# EAGLE design module (EAGLE 9.6.2)

## Sheet 1 of 5
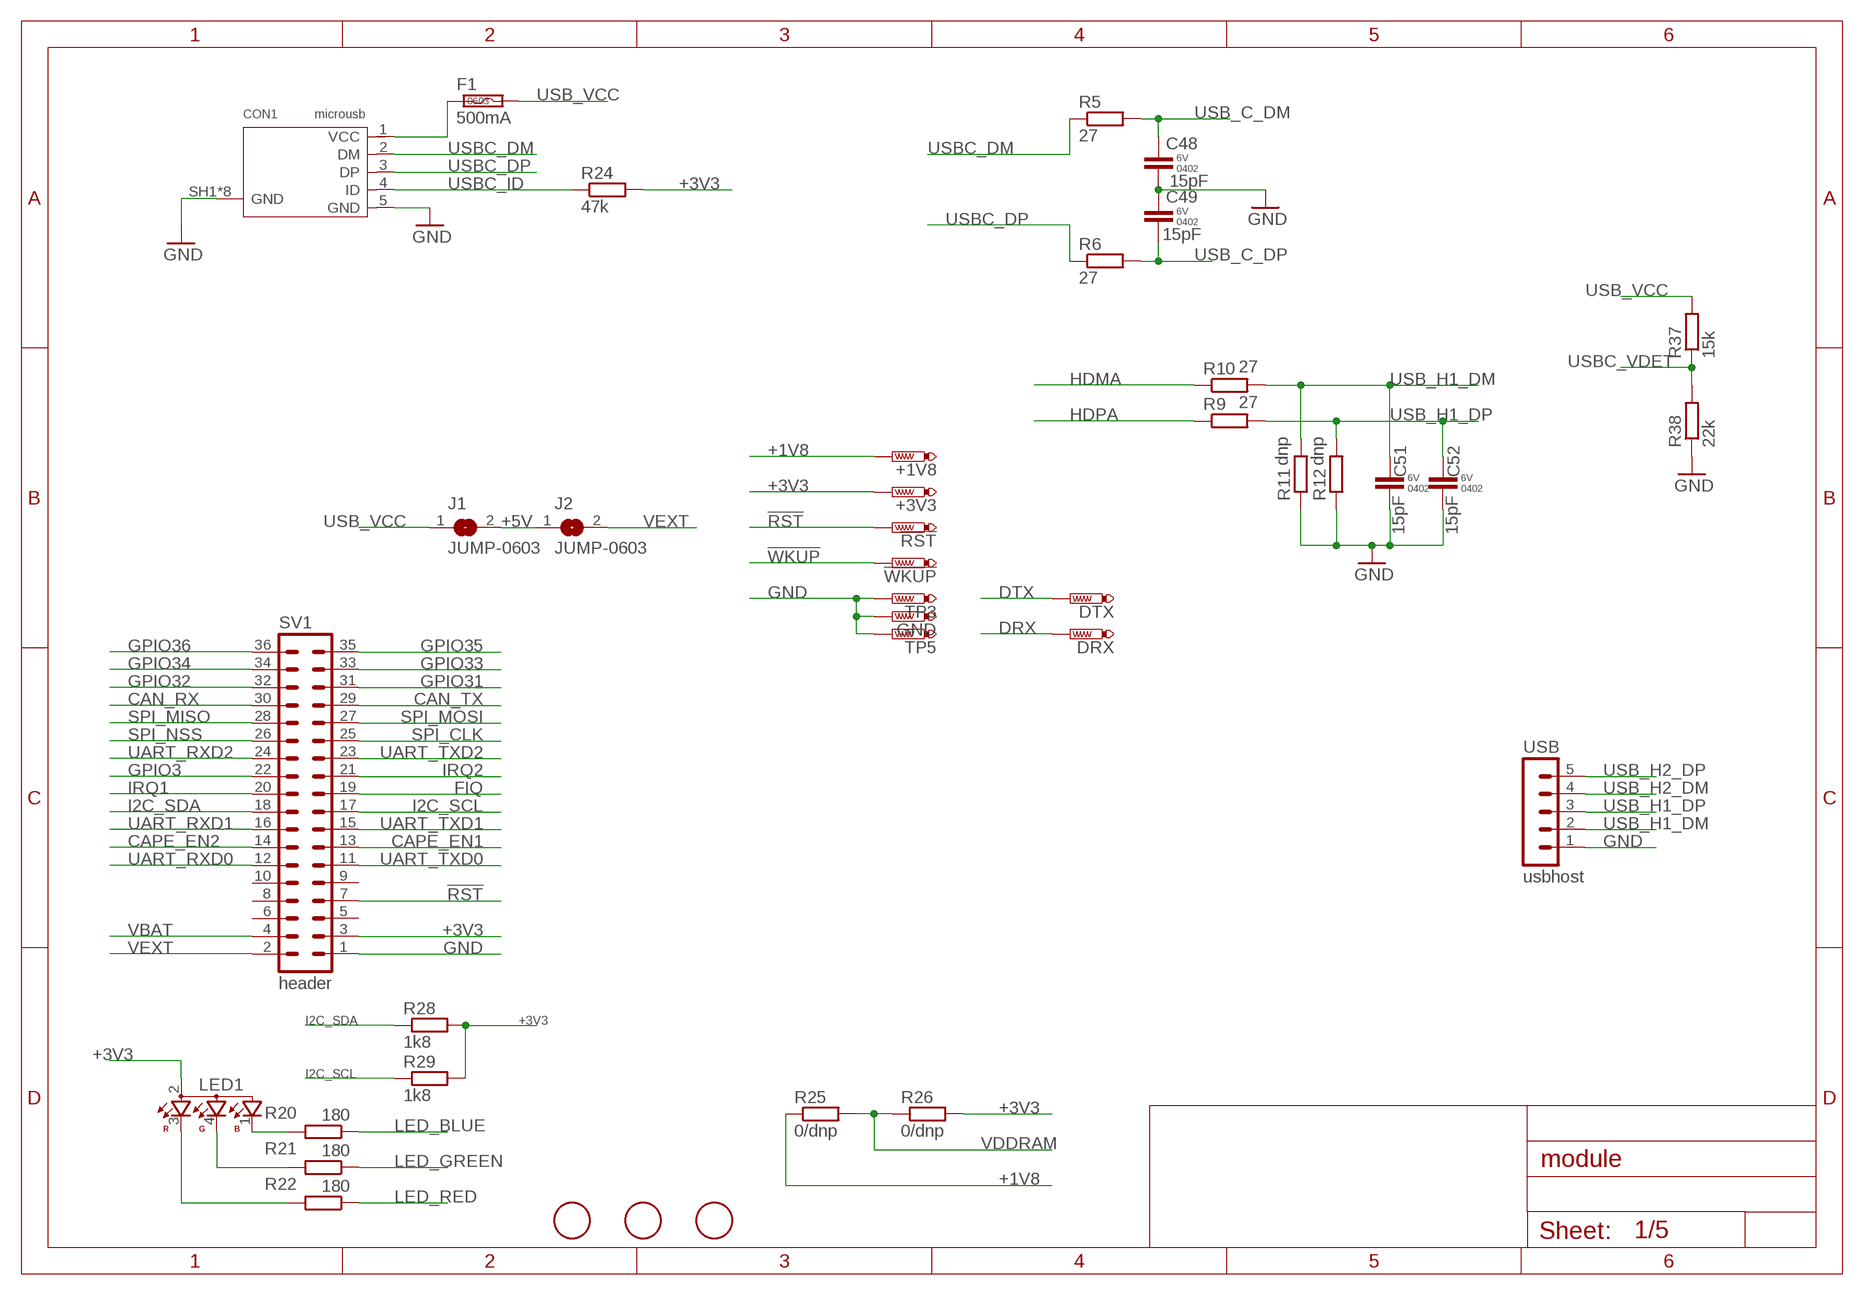
[diagram p0: schematic, sheet 1]

### Parts
!RST  PTR1B1,27  [B1,27]
!WKUP  PTR1B1,27  [B1,27]
+1V8  PTR1B1,27  [B1,27]
+3V3  PTR1B1,27  [B1,27]
C48  15pF  CAP-0402  [C0402K]
C49  15pF  CAP-0402  [C0402K]
C51  15pF  CAP-0402  [C0402K]
C52  15pF  CAP-0402  [C0402K]
CON1  microusb  10118194-0001LF  [10118194]
DRX  PTR1B1,27  [B1,27]
DTX  PTR1B1,27  [B1,27]
F1  500mA  FUSE-PTC-0603  [F0603]
GND  PTR1B1,27  [B1,27]
J1  JUMP-0603  [C0603]
J2  JUMP-0603  [C0603]
LED1  OSTB1204C1E  [321015RGB]
R5  27  R-EU_R0402  [R0402]
R6  27  R-EU_R0402  [R0402]
R9  27  R-EU_R0402  [R0402]
R10  27  R-EU_R0402  [R0402]
R11  dnp  R-EU_R0402  [R0402]
R12  dnp  R-EU_R0402  [R0402]
R20  180  R-EU_R0402  [R0402]
R21  180  R-EU_R0402  [R0402]
R22  180  R-EU_R0402  [R0402]
R24  47k  R-EU_R0402  [R0402]
R25  0/dnp  R-EU_R0603  [R0603]
R26  0/dnp  R-EU_R0603  [R0603]
R28  1k8  R-EU_R0402  [R0402]
R29  1k8  R-EU_R0402  [R0402]
R37  15k  R-EU_R0402  [R0402]
R38  22k  R-EU_R0402  [R0402]
SV1  header  MA18-2  [MA18-2]
TP3  PTR1B1,27  [B1,27]
TP5  PTR1B1,27  [B1,27]
U$1  FIDUCIAL  [FIDUCIAL_1MM]
U$2  FIDUCIAL  [FIDUCIAL_1MM]
U$3  FIDUCIAL  [FIDUCIAL_1MM]
USB  usbhost  MA05-1  [MA05-1]

### Nets
!RST: !RST.TP SV1.7 ; also sheet 2
!WKUP: !WKUP.TP ; also sheet 2
+1V8: +1V8.TP R25.1 ; also sheet 2,4
+3V3: +3V3.TP LED1.2 R24.2 R26.2 R28.2 R29.2 SV1.3 ; also sheet 2,4,5
+5V: J1.2 J2.1
CAN_RX: SV1.30
CAN_TX: SV1.29
CAPE_EN1: SV1.13 ; also sheet 2
CAPE_EN2: SV1.14 ; also sheet 2
DRX: DRX.TP ; also sheet 2
DTX: DTX.TP ; also sheet 2
FIQ: SV1.19 ; also sheet 2
GND: C48.2 C49.2 C51.2 C52.2 CON1.5(GND) CON1.SH1(GND) CON1.SH2(GND) CON1.SH3(GND) CON1.SH4(GND) CON1.SH5(GND) CON1.SH6(GND) CON1.SH7(GND) CON1.SH8(GND) GND.TP R11.1 R12.1 R38.1 SV1.1 TP3.TP TP5.TP USB.1 ; also sheet 2,3,4,5
GPIO3: SV1.22 ; also sheet 2
GPIO31: SV1.31 ; also sheet 2
GPIO32: SV1.32 ; also sheet 2
GPIO33: SV1.33 ; also sheet 2
GPIO34: SV1.34 ; also sheet 2
GPIO35: SV1.35 ; also sheet 2
GPIO36: SV1.36 ; also sheet 2
HDMA: R10.1 ; also sheet 2
HDPA: R9.1 ; also sheet 2
I2C_SCL: R29.1 SV1.17 ; also sheet 2
I2C_SDA: R28.1 SV1.18 ; also sheet 2
IRQ1: SV1.20 ; also sheet 2
IRQ2: SV1.21 ; also sheet 2
LED_BLUE: R20.1 ; also sheet 2
LED_GREEN: R21.1 ; also sheet 2
LED_RED: R22.1 ; also sheet 2
N$4: CON1.1(VCC) F1.1
N$9: LED1.1 R20.2
N$14: LED1.4 R21.2
N$23: LED1.3 R22.2
SPI_CLK: SV1.25 ; also sheet 2
SPI_MISO: SV1.28 ; also sheet 2
SPI_MOSI: SV1.27 ; also sheet 2
SPI_NSS: SV1.26 ; also sheet 2
UART_RXD0: SV1.12 ; also sheet 2
UART_RXD1: SV1.16 ; also sheet 2
UART_RXD2: SV1.24 ; also sheet 2
UART_TXD0: SV1.11 ; also sheet 2
UART_TXD1: SV1.15 ; also sheet 2
UART_TXD2: SV1.23 ; also sheet 2
USB_C_DM: C48.1 R5.2 ; also sheet 2
USB_C_DP: C49.1 R6.2 ; also sheet 2
USB_H1_DM: C51.1 R10.2 R11.2 USB.2
USB_H1_DP: C52.1 R9.2 R12.2 USB.3
USB_H2_DM: USB.4
USB_H2_DP: USB.5
USB_VCC: F1.2 J1.1 R37.2
USBC_DM: CON1.2(DM) R5.1
USBC_DP: CON1.3(DP) R6.1
USBC_ID: CON1.4(ID) R24.1 ; also sheet 2
USBC_VDET: R37.1 R38.2 ; also sheet 2
VBAT: SV1.4
VDDRAM: R25.2 R26.1 ; also sheet 3,4
VEXT: J2.2 SV1.2
Unconnected: SV1.5 SV1.6 SV1.8 SV1.9 SV1.10

## Sheet 2 of 5
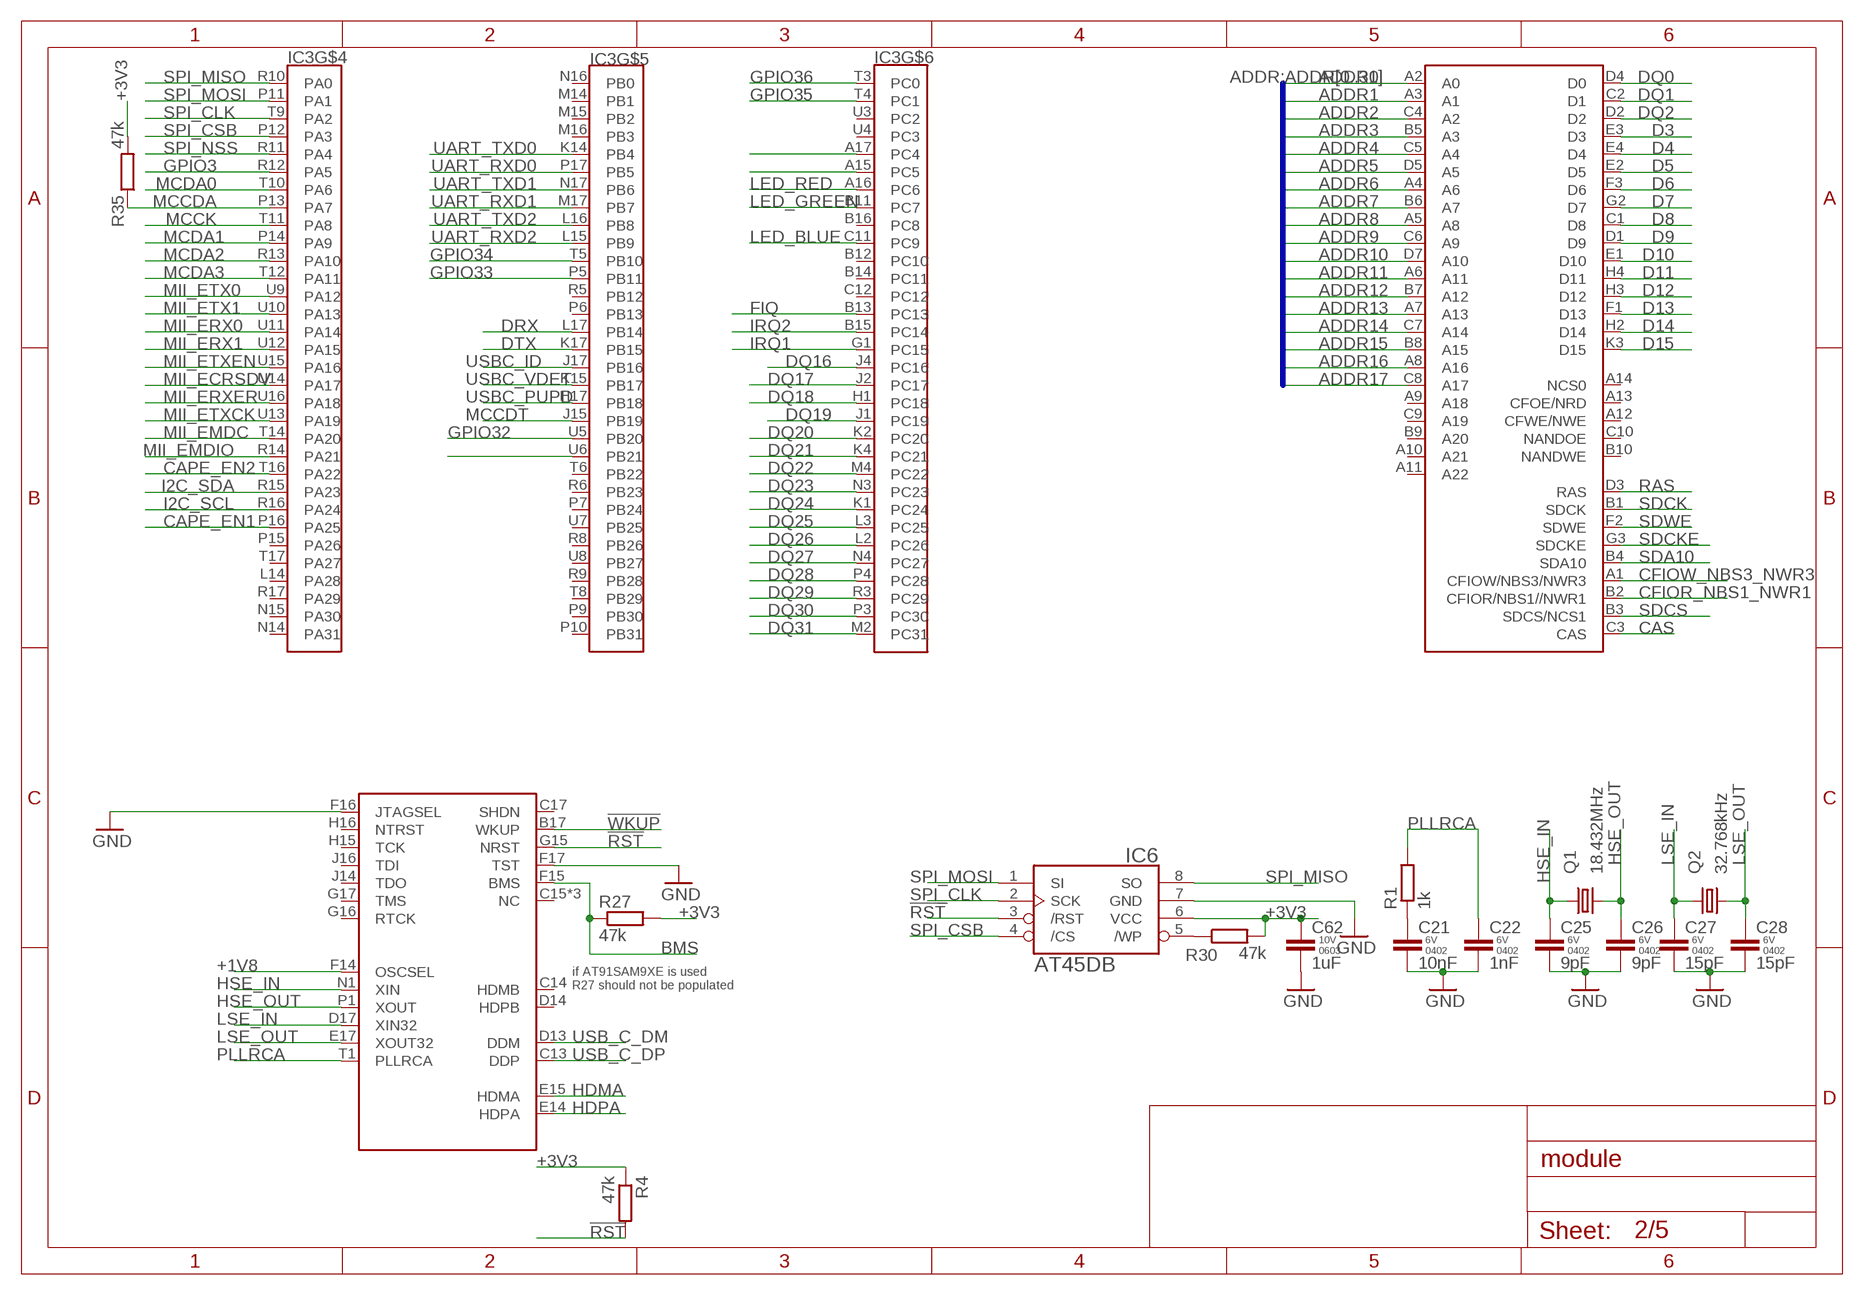
[diagram p1: schematic, sheet 2]

### Parts
C21  10nF  CAP-0402  [C0402K]
C22  1nF  CAP-0402  [C0402K]
C25  9pF  CAP-0402  [C0402K]
C26  9pF  CAP-0402  [C0402K]
C27  15pF  CAP-0402  [C0402K]
C28  15pF  CAP-0402  [C0402K]
C62  1uF  CAP-0603  [C0603]
IC3  AT91SAM9260-BGA  [BGA217C80P17X17_1500X1500X100]
IC6  AT45DB-S  [SO08-208]
Q1  18.432MHz  3215-7  [3215]
Q2  32.768kHz  CFPX–217-NHT  [3215]
R1  1k  R-EU_R0402  [R0402]
R4  47k  R-EU_R0402  [R0402]
R27  47k  R-EU_R0402  [R0402]
R30  47k  R-EU_R0402  [R0402]
R35  47k  R-EU_R0402  [R0402]

### Nets
!RST: IC3.G15(NRST) IC6.3(/RST) R4.2 ; also sheet 1
!WKUP: IC3.B17(WKUP) ; also sheet 1
+1V8: IC3.F14(OSCSEL) ; also sheet 1,4
+3V3: C62.1 IC6.6(VCC) R4.1 R27.2 R30.2 R35.2 ; also sheet 1,4,5
ADDR0: IC3.A2(A0)
ADDR1: IC3.A3(A1)
ADDR2: IC3.C4(A2)
ADDR3: IC3.B5(A3)
ADDR4: IC3.C5(A4)
ADDR5: IC3.D5(A5)
ADDR6: IC3.A4(A6)
ADDR7: IC3.B6(A7)
ADDR8: IC3.A5(A8)
ADDR9: IC3.C6(A9)
ADDR10: IC3.D7(A10)
ADDR11: IC3.A6(A11)
ADDR12: IC3.B7(A12)
ADDR13: IC3.A7(A13)
ADDR14: IC3.C7(A14)
ADDR15: IC3.B8(A15)
ADDR16: IC3.A8(A16)
ADDR17: IC3.C8(A17)
BMS: IC3.F15(BMS) R27.1
CAPE_EN1: IC3.P16(PA25) ; also sheet 1
CAPE_EN2: IC3.T16(PA22) ; also sheet 1
CAS: IC3.C3(CAS) ; also sheet 3
CFIOR_NBS1_NWR1: IC3.B2(CFIOR/NBS1//NWR1) ; also sheet 3
CFIOW_NBS3_NWR3: IC3.A1(CFIOW/NBS3/NWR3) ; also sheet 3
D3: IC3.E3(D3) ; also sheet 3
D4: IC3.E4(D4) ; also sheet 3
D5: IC3.E2(D5) ; also sheet 3
D6: IC3.F3(D6) ; also sheet 3
D7: IC3.G2(D7) ; also sheet 3
D8: IC3.C1(D8) ; also sheet 3
D9: IC3.D1(D9) ; also sheet 3
D10: IC3.E1(D10) ; also sheet 3
D11: IC3.H4(D11) ; also sheet 3
D12: IC3.H3(D12) ; also sheet 3
D13: IC3.F1(D13) ; also sheet 3
D14: IC3.H2(D14) ; also sheet 3
D15: IC3.K3(D15) ; also sheet 3
DQ0: IC3.D4(D0) ; also sheet 3
DQ1: IC3.C2(D1) ; also sheet 3
DQ2: IC3.D2 ; also sheet 3
DQ16: IC3.J4(PC16) ; also sheet 3
DQ17: IC3.J2(PC17) ; also sheet 3
DQ18: IC3.H1(PC18) ; also sheet 3
DQ19: IC3.J1(PC19) ; also sheet 3
DQ20: IC3.K2(PC20) ; also sheet 3
DQ21: IC3.K4(PC21) ; also sheet 3
DQ22: IC3.M4(PC22) ; also sheet 3
DQ23: IC3.N3(PC23) ; also sheet 3
DQ24: IC3.K1(PC24) ; also sheet 3
DQ25: IC3.L3(PC25) ; also sheet 3
DQ26: IC3.L2(PC26) ; also sheet 3
DQ27: IC3.N4(PC27) ; also sheet 3
DQ28: IC3.P4(PC28) ; also sheet 3
DQ29: IC3.R3(PC29) ; also sheet 3
DQ30: IC3.P3(PC30) ; also sheet 3
DQ31: IC3.M2(PC31) ; also sheet 3
DRX: IC3.L17(PB14) ; also sheet 1
DTX: IC3.K17(PB15) ; also sheet 1
FIQ: IC3.B13(PC13) ; also sheet 1
GND: C21.2 C22.2 C25.2 C26.2 C27.2 C28.2 C62.2 IC3.F17(TST) IC6.7(GND) ; also sheet 1,3,4,5
GPIO3: IC3.R12(PA5) ; also sheet 1
GPIO31: IC3.U6(PB21) ; also sheet 1
GPIO32: IC3.U5(PB20) ; also sheet 1
GPIO33: IC3.P5(PB11) ; also sheet 1
GPIO34: IC3.T5(PB10) ; also sheet 1
GPIO35: IC3.T4(PC1) ; also sheet 1
GPIO36: IC3.T3(PC0) ; also sheet 1
HDMA: IC3.E15(HDMA) ; also sheet 1
HDPA: IC3.E14(HDPA) ; also sheet 1
HSE_IN: C25.1 IC3.N1(XIN) Q1.1
HSE_OUT: C26.1 IC3.P1(XOUT) Q1.3
I2C_SCL: IC3.R16(PA24) ; also sheet 1
I2C_SDA: IC3.R15(PA23) ; also sheet 1
IRQ1: IC3.G1(PC15) ; also sheet 1
IRQ2: IC3.B15(PC14) ; also sheet 1
LED_BLUE: IC3.C11(PC9) ; also sheet 1
LED_GREEN: IC3.B11(PC7) ; also sheet 1
LED_RED: IC3.A16(PC6) ; also sheet 1
LSE_IN: C27.1 IC3.D17(XIN32) Q2.1
LSE_OUT: C28.1 IC3.E17(XOUT32) Q2.2
MCCDA: IC3.P13(PA7) R35.1 ; also sheet 5
MCCDT: IC3.J15(PB19) ; also sheet 5
MCCK: IC3.T11(PA8) ; also sheet 5
MCDA0: IC3.T10(PA6) ; also sheet 5
MCDA1: IC3.P14(PA9) ; also sheet 5
MCDA2: IC3.R13(PA10) ; also sheet 5
MCDA3: IC3.T12(PA11) ; also sheet 5
MII_ECRSDV: IC3.U14(PA17) ; also sheet 5
MII_EMDC: IC3.T14(PA20) ; also sheet 5
MII_EMDIO: IC3.R14(PA21) ; also sheet 5
MII_ERX0: IC3.U11(PA14) ; also sheet 5
MII_ERX1: IC3.U12(PA15) ; also sheet 5
MII_ERXER: IC3.U16(PA18) ; also sheet 5
MII_ETX0: IC3.U9(PA12) ; also sheet 5
MII_ETX1: IC3.U10(PA13) ; also sheet 5
MII_ETXCK: IC3.U13(PA19) ; also sheet 5
MII_ETXEN: IC3.U15(PA16) ; also sheet 5
N$1: C21.1 R1.1
N$2: IC6.5(/WP) R30.1
N$12: IC3.F16(JTAGSEL) ; supply symbol labelled GND
N$13: IC3.A15(PC5)
N$16: IC3.A17(PC4)
PLLRCA: C22.1 IC3.T1(PLLRCA) R1.2
RAS: IC3.D3(RAS) ; also sheet 3
SDA10: IC3.B4(SDA10) ; also sheet 3
SDCK: IC3.B1(SDCK) ; also sheet 3
SDCKE: IC3.G3(SDCKE) ; also sheet 3
SDCS: IC3.B3(SDCS/NCS1) ; also sheet 3
SDWE: IC3.F2(SDWE) ; also sheet 3
SPI_CLK: IC3.T9(PA2) IC6.2(SCK) ; also sheet 1
SPI_CSB: IC3.P12(PA3) IC6.4(/CS)
SPI_MISO: IC3.R10(PA0) IC6.8(SO) ; also sheet 1
SPI_MOSI: IC3.P11(PA1) IC6.1(SI) ; also sheet 1
SPI_NSS: IC3.R11(PA4) ; also sheet 1
UART_RXD0: IC3.P17(PB5) ; also sheet 1
UART_RXD1: IC3.M17(PB7) ; also sheet 1
UART_RXD2: IC3.L15(PB9) ; also sheet 1
UART_TXD0: IC3.K14(PB4) ; also sheet 1
UART_TXD1: IC3.N17(PB6) ; also sheet 1
UART_TXD2: IC3.L16(PB8) ; also sheet 1
USB_C_DM: IC3.D13(DDM) ; also sheet 1
USB_C_DP: IC3.C13(DDP) ; also sheet 1
USBC_ID: IC3.J17(PB16) ; also sheet 1
USBC_PUPD: IC3.H17(PB18)
USBC_VDET: IC3.K15(PB17) ; also sheet 1
Unconnected: IC3.A9(A18) IC3.A10(A21) IC3.A11(A22) IC3.A12(CFWE/NWE) IC3.A13(CFOE/NRD) IC3.A14(NCS0) IC3.B9(A20) IC3.B10(NANDWE) IC3.B12(PC10) IC3.B14(PC11) IC3.B16(PC8) IC3.C9(A19) IC3.C10(NANDOE) IC3.C12 IC3.C14(HDMB) IC3.C15(NC) IC3.C17(SHDN) IC3.D14(HDPB) IC3.D15(NC) IC3.G16(RTCK) IC3.G17(TMS) IC3.H15(TCK) IC3.H16(NTRST) IC3.J14(TDO) IC3.J16(TDI) IC3.L14(PA28) IC3.M14(PB1) IC3.M15(PB2) IC3.M16(PB3) IC3.N14(PA31) IC3.N15(PA30) IC3.N16(PB0) IC3.P6(PB13) IC3.P7(PB24) IC3.P9(PB30) IC3.P10(PB31) IC3.P15(PA26) IC3.R1(NC) IC3.R5(PB12) IC3.R6(PB23) IC3.R8(PB26) IC3.R9(PB28) IC3.R17(PA29) IC3.T6(PB22) IC3.T8(PB29) IC3.T17(PA27) IC3.U3(PC2) IC3.U4(PC3) IC3.U7(PB25) IC3.U8(PB27)

### Buses
ADDR:ADDR[0..31]

### Notes on the sheet
- if AT91SAM9XE is used 
  R27 should not be populated

## Sheet 3 of 5: SDRAM
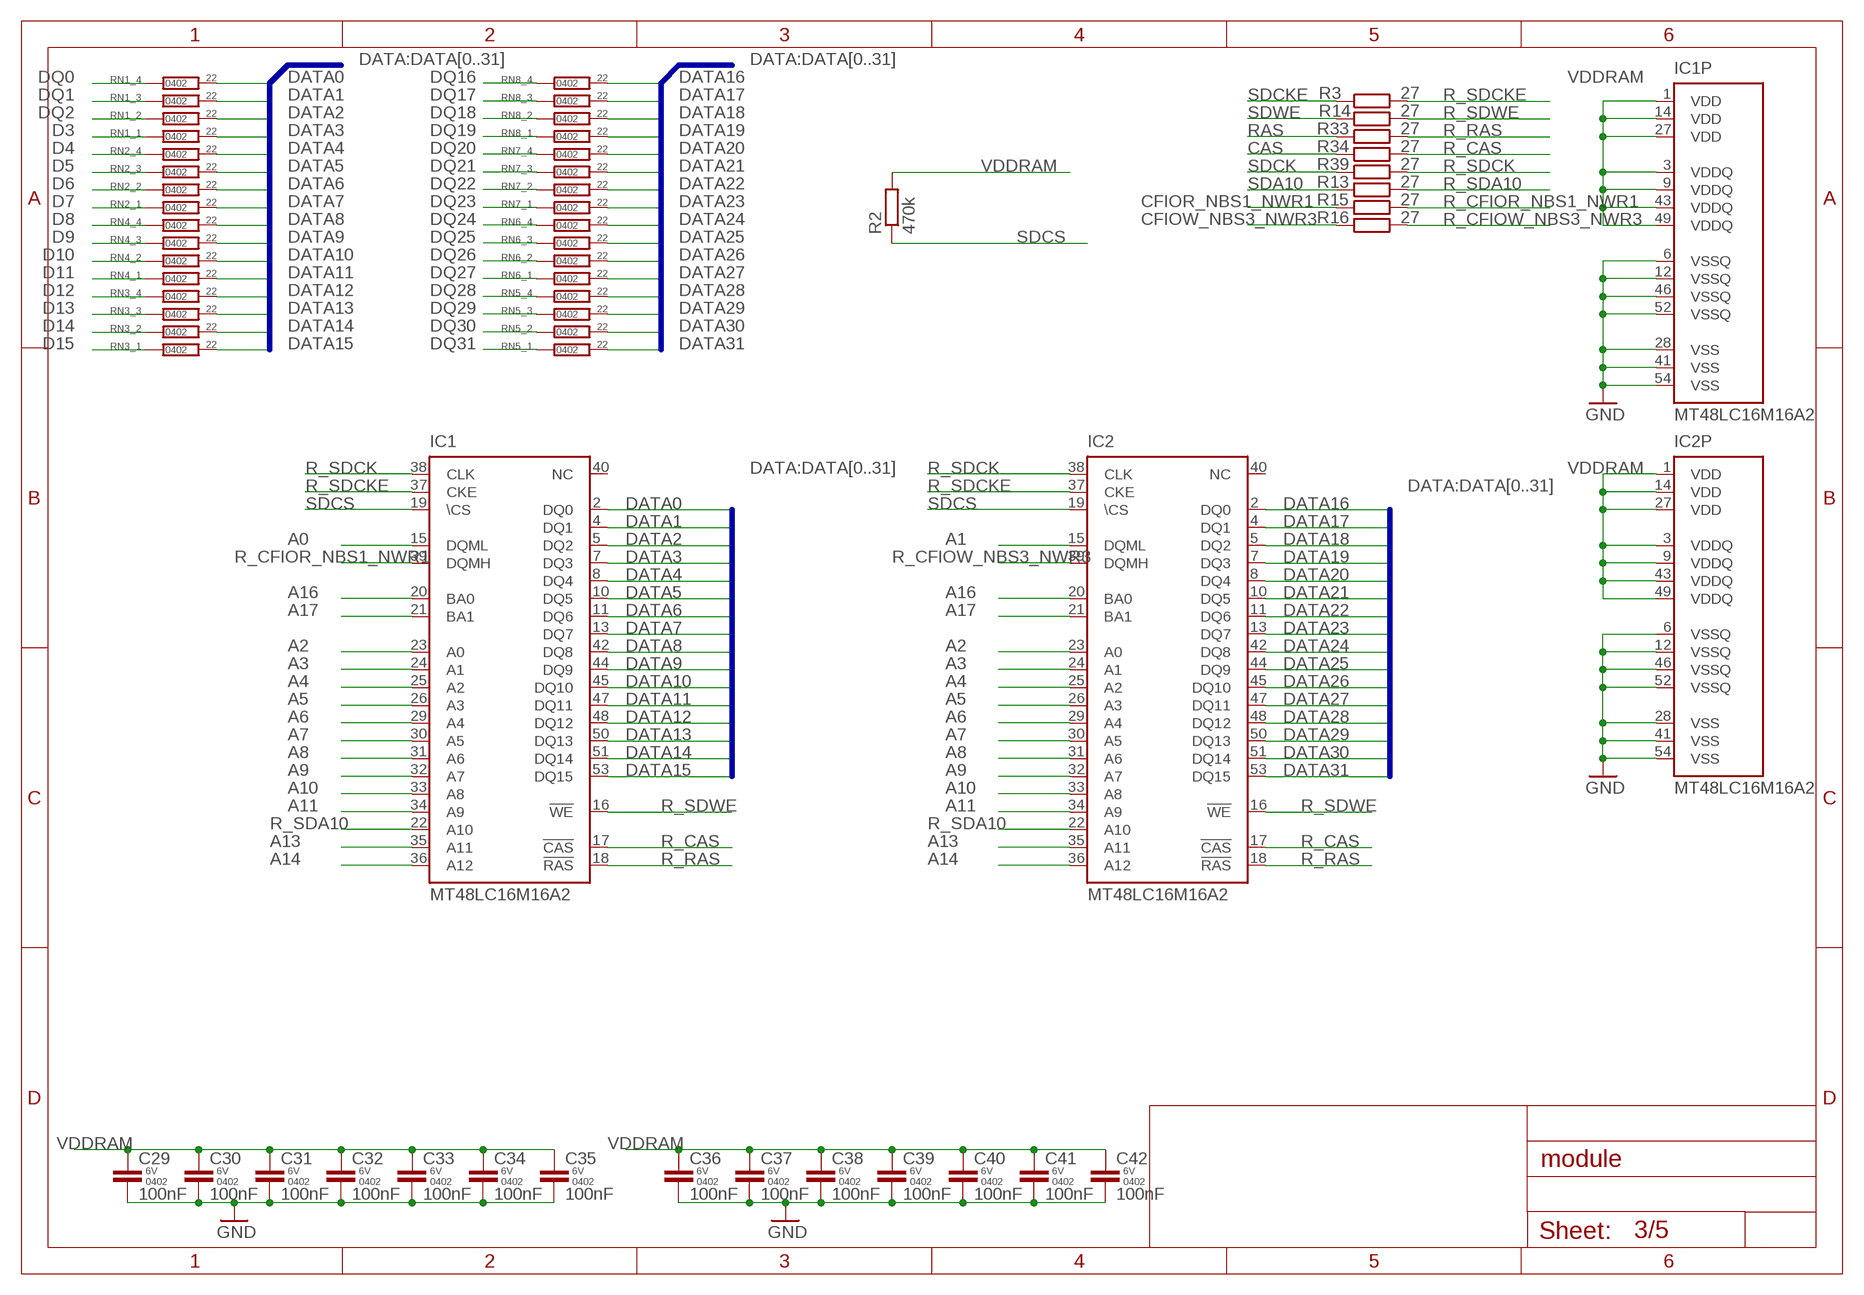
[diagram p2: schematic, sheet 3]

### Parts
C29  100nF  CAP-0402  [C0402K]
C30  100nF  CAP-0402  [C0402K]
C31  100nF  CAP-0402  [C0402K]
C32  100nF  CAP-0402  [C0402K]
C33  100nF  CAP-0402  [C0402K]
C34  100nF  CAP-0402  [C0402K]
C35  100nF  CAP-0402  [C0402K]
C36  100nF  CAP-0402  [C0402K]
C37  100nF  CAP-0402  [C0402K]
C38  100nF  CAP-0402  [C0402K]
C39  100nF  CAP-0402  [C0402K]
C40  100nF  CAP-0402  [C0402K]
C41  100nF  CAP-0402  [C0402K]
C42  100nF  CAP-0402  [C0402K]
IC1  MT48LC16M16A2  [TSOP54-400]
IC2  MT48LC16M16A2  [TSOP54-400]
R2  470k  R-EU_R0402  [R0402]
R3  27  R-EU_R0402  [R0402]
R13  27  R-EU_R0402  [R0402]
R14  27  R-EU_R0402  [R0402]
R15  27  R-EU_R0402  [R0402]
R16  27  R-EU_R0402  [R0402]
R33  27  R-EU_R0402  [R0402]
R34  27  R-EU_R0402  [R0402]
R39  27  R-EU_R0402  [R0402]
RN1  22  4D02WGJ0220  [4D02]
RN2  22  4D02WGJ0220  [4D02]
RN3  22  4D02WGJ0220  [4D02]
RN4  22  4D02WGJ0220  [4D02]
RN5  22  4D02WGJ0220  [4D02]
RN6  22  4D02WGJ0220  [4D02]
RN7  22  4D02WGJ0220  [4D02]
RN8  22  4D02WGJ0220  [4D02]

### Nets
A0: IC1.15(DQML)
A1: IC2.15(DQML)
A2: IC1.23(A0) IC2.23(A0)
A3: IC1.24(A1) IC2.24(A1)
A4: IC1.25(A2) IC2.25(A2)
A5: IC1.26(A3) IC2.26(A3)
A6: IC1.29(A4) IC2.29(A4)
A7: IC1.30(A5) IC2.30(A5)
A8: IC1.31(A6) IC2.31(A6)
A9: IC1.32(A7) IC2.32(A7)
A10: IC1.33(A8) IC2.33(A8)
A11: IC1.34(A9) IC2.34(A9)
A13: IC1.35(A11) IC2.35(A11)
A14: IC1.36(A12) IC2.36(A12)
A16: IC1.20(BA0) IC2.20(BA0)
A17: IC1.21(BA1) IC2.21(BA1)
CAS: R34.1 ; also sheet 2
CFIOR_NBS1_NWR1: R15.1 ; also sheet 2
CFIOW_NBS3_NWR3: R16.1 ; also sheet 2
D3: RN1.1 ; also sheet 2
D4: RN2.4 ; also sheet 2
D5: RN2.3 ; also sheet 2
D6: RN2.2 ; also sheet 2
D7: RN2.1 ; also sheet 2
D8: RN4.4 ; also sheet 2
D9: RN4.3 ; also sheet 2
D10: RN4.2 ; also sheet 2
D11: RN4.1 ; also sheet 2
D12: RN3.4 ; also sheet 2
D13: RN3.3 ; also sheet 2
D14: RN3.2 ; also sheet 2
D15: RN3.1 ; also sheet 2
DATA0 [sdram]: IC1.2(DQ0) RN1.5
DATA1 [sdram]: IC1.4(DQ1) RN1.6
DATA2 [sdram]: IC1.5(DQ2) RN1.7
DATA3 [sdram]: IC1.7(DQ3) RN1.8
DATA4 [sdram]: IC1.8(DQ4) RN2.5
DATA5 [sdram]: IC1.10(DQ5) RN2.6
DATA6 [sdram]: IC1.11(DQ6) RN2.7
DATA7 [sdram]: IC1.13(DQ7) RN2.8
DATA8 [sdram]: IC1.42(DQ8) RN4.5
DATA9 [sdram]: IC1.44(DQ9) RN4.6
DATA10 [sdram]: IC1.45(DQ10) RN4.7
DATA11 [sdram]: IC1.47(DQ11) RN4.8
DATA12 [sdram]: IC1.48(DQ12) RN3.5
DATA13 [sdram]: IC1.50(DQ13) RN3.6
DATA14 [sdram]: IC1.51(DQ14) RN3.7
DATA15 [sdram]: IC1.53(DQ15) RN3.8
DATA16 [sdram]: IC2.2(DQ0) RN8.5
DATA17 [sdram]: IC2.4(DQ1) RN8.6
DATA18 [sdram]: IC2.5(DQ2) RN8.7
DATA19 [sdram]: IC2.7(DQ3) RN8.8
DATA20 [sdram]: IC2.8(DQ4) RN7.5
DATA21 [sdram]: IC2.10(DQ5) RN7.6
DATA22 [sdram]: IC2.11(DQ6) RN7.7
DATA23 [sdram]: IC2.13(DQ7) RN7.8
DATA24 [sdram]: IC2.42(DQ8) RN6.5
DATA25 [sdram]: IC2.44(DQ9) RN6.6
DATA26 [sdram]: IC2.45(DQ10) RN6.7
DATA27 [sdram]: IC2.47(DQ11) RN6.8
DATA28 [sdram]: IC2.48(DQ12) RN5.5
DATA29 [sdram]: IC2.50(DQ13) RN5.6
DATA30 [sdram]: IC2.51(DQ14) RN5.7
DATA31 [sdram]: IC2.53(DQ15) RN5.8
DQ0: RN1.4 ; also sheet 2
DQ1: RN1.3 ; also sheet 2
DQ2: RN1.2 ; also sheet 2
DQ16: RN8.4 ; also sheet 2
DQ17: RN8.3 ; also sheet 2
DQ18: RN8.2 ; also sheet 2
DQ19: RN8.1 ; also sheet 2
DQ20: RN7.4 ; also sheet 2
DQ21: RN7.3 ; also sheet 2
DQ22: RN7.2 ; also sheet 2
DQ23: RN7.1 ; also sheet 2
DQ24: RN6.4 ; also sheet 2
DQ25: RN6.3 ; also sheet 2
DQ26: RN6.2 ; also sheet 2
DQ27: RN6.1 ; also sheet 2
DQ28: RN5.4 ; also sheet 2
DQ29: RN5.3 ; also sheet 2
DQ30: RN5.2 ; also sheet 2
DQ31: RN5.1 ; also sheet 2
GND: C29.2 C30.2 C31.2 C32.2 C33.2 C34.2 C35.2 C36.2 C37.2 C38.2 C39.2 C40.2 C41.2 C42.2 IC1.6(VSSQ) IC1.12(VSSQ) IC1.28(VSS) IC1.41(VSS) IC1.46(VSSQ) IC1.52(VSSQ) IC1.54(VSS) IC2.6(VSSQ) IC2.12(VSSQ) IC2.28(VSS) IC2.41(VSS) IC2.46(VSSQ) IC2.52(VSSQ) IC2.54(VSS) ; also sheet 1,2,4,5
R_CAS: IC1.17(!CAS) IC2.17(!CAS) R34.2
R_CFIOR_NBS1_NWR1: IC1.39(DQMH) R15.2
R_CFIOW_NBS3_NWR3: IC2.39(DQMH) R16.2
R_RAS: IC1.18(!RAS) IC2.18(!RAS) R33.2
R_SDA10: IC1.22(A10) IC2.22(A10) R13.2
R_SDCK: IC1.38(CLK) IC2.38(CLK) R39.2
R_SDCKE: IC1.37(CKE) IC2.37(CKE) R3.2
R_SDWE: IC1.16(!WE) IC2.16(!WE) R14.2
RAS: R33.1 ; also sheet 2
SDA10: R13.1 ; also sheet 2
SDCK: R39.1 ; also sheet 2
SDCKE: R3.1 ; also sheet 2
SDCS: IC1.19(\CS) IC2.19(\CS) R2.1 ; also sheet 2
SDWE: R14.1 ; also sheet 2
VDDRAM: C29.1 C30.1 C31.1 C32.1 C33.1 C34.1 C35.1 C36.1 C37.1 C38.1 C39.1 C40.1 C41.1 C42.1 IC1.1(VDD) IC1.3(VDDQ) IC1.9(VDDQ) IC1.14(VDD) IC1.27(VDD) IC1.43(VDDQ) IC1.49(VDDQ) IC2.1(VDD) IC2.3(VDDQ) IC2.9(VDDQ) IC2.14(VDD) IC2.27(VDD) IC2.43(VDDQ) IC2.49(VDDQ) R2.2 ; also sheet 1,4
Unconnected: IC1.40(NC) IC2.40(NC)

### Buses
DATA:DATA[0..31]

## Sheet 4 of 5: Power
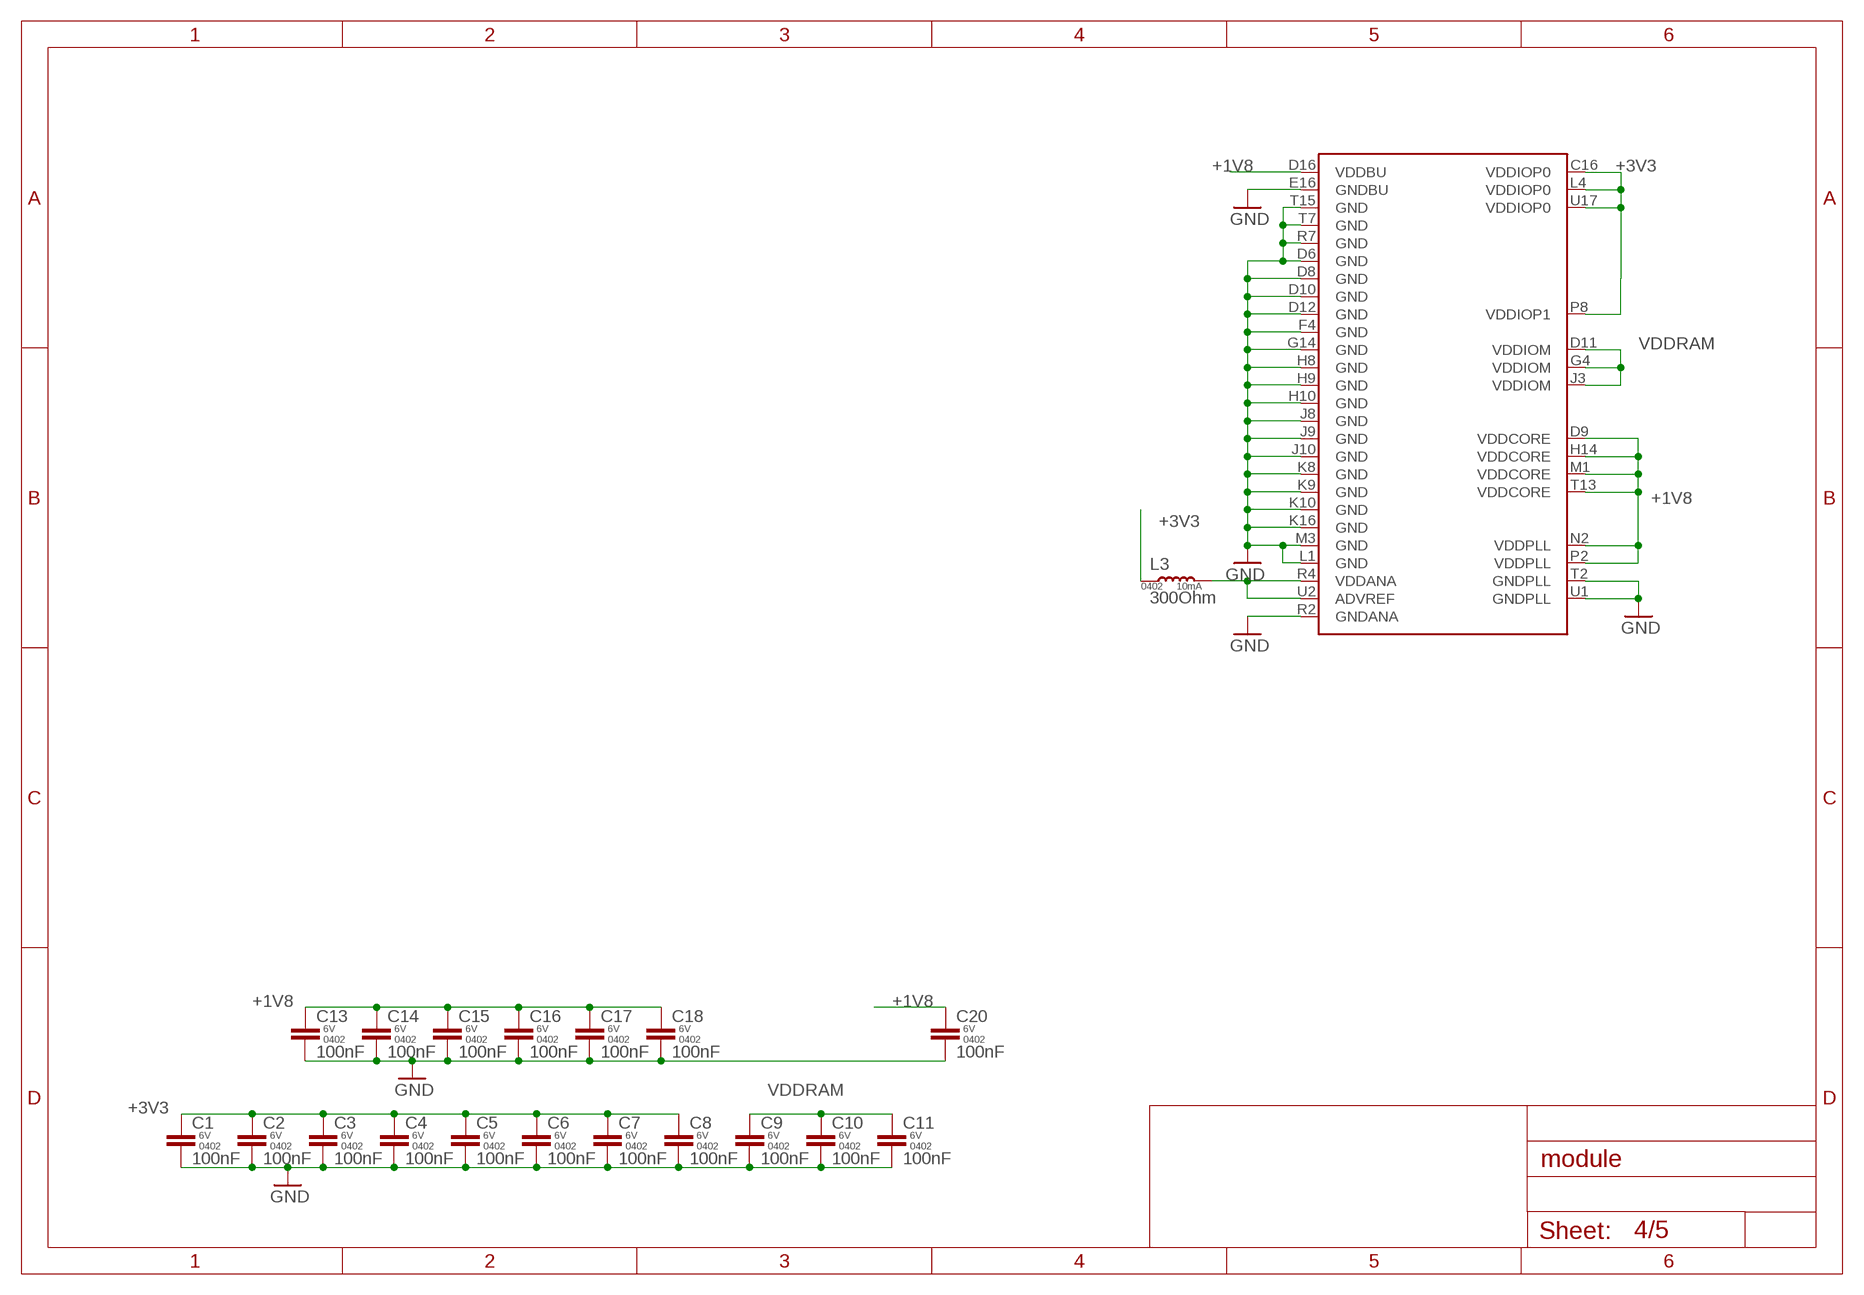
[diagram p3: schematic, sheet 4]

### Parts
C1  100nF  CAP-0402  [C0402K]
C2  100nF  CAP-0402  [C0402K]
C3  100nF  CAP-0402  [C0402K]
C4  100nF  CAP-0402  [C0402K]
C5  100nF  CAP-0402  [C0402K]
C6  100nF  CAP-0402  [C0402K]
C7  100nF  CAP-0402  [C0402K]
C8  100nF  CAP-0402  [C0402K]
C9  100nF  CAP-0402  [C0402K]
C10  100nF  CAP-0402  [C0402K]
C11  100nF  CAP-0402  [C0402K]
C13  100nF  CAP-0402  [C0402K]
C14  100nF  CAP-0402  [C0402K]
C15  100nF  CAP-0402  [C0402K]
C16  100nF  CAP-0402  [C0402K]
C17  100nF  CAP-0402  [C0402K]
C18  100nF  CAP-0402  [C0402K]
C20  100nF  CAP-0402  [C0402K]
L3  300Ohm  IND-0402  [L0402]

### Nets
+1V8: C13.1 C14.1 C15.1 C16.1 C17.1 C18.1 C20.1 IC3.D9(VDDCORE) IC3.D16(VDDBU) IC3.H14(VDDCORE) IC3.M1(VDDCORE) IC3.N2(VDDPLL) IC3.P2(VDDPLL) IC3.T13(VDDCORE) ; also sheet 1,2
+3V3: C1.1 C2.1 C3.1 C4.1 C5.1 C6.1 C7.1 C8.1 IC3.C16(VDDIOP0) IC3.L4(VDDIOP0) IC3.P8(VDDIOP1) IC3.U17(VDDIOP0) L3.1 ; also sheet 1,2,5
GND: C1.2 C2.2 C3.2 C4.2 C5.2 C6.2 C7.2 C8.2 C9.2 C10.2 C11.2 C13.2 C14.2 C15.2 C16.2 C17.2 C18.2 C20.2 IC3.D6(GND) IC3.D8(GND) IC3.D10(GND) IC3.D12(GND) IC3.E16(GNDBU) IC3.F4(GND) IC3.G14(GND) IC3.H8(GND) IC3.H9(GND) IC3.H10(GND) IC3.J8(GND) IC3.J9(GND) IC3.J10(GND) IC3.K8(GND) IC3.K9(GND) IC3.K10(GND) IC3.K16(GND) IC3.L1(GND) IC3.M3(GND) IC3.R2(GNDANA) IC3.R7(GND) IC3.T2(GNDPLL) IC3.T7(GND) IC3.T15(GND) IC3.U1(GNDPLL) ; also sheet 1,2,3,5
N$28: IC3.R4(VDDANA) IC3.U2(ADVREF) L3.2
VDDRAM: C9.1 C10.1 C11.1 IC3.D11(VDDIOM) IC3.G4(VDDIOM) IC3.J3(VDDIOM) ; also sheet 1,3

## Sheet 5 of 5: SD Card
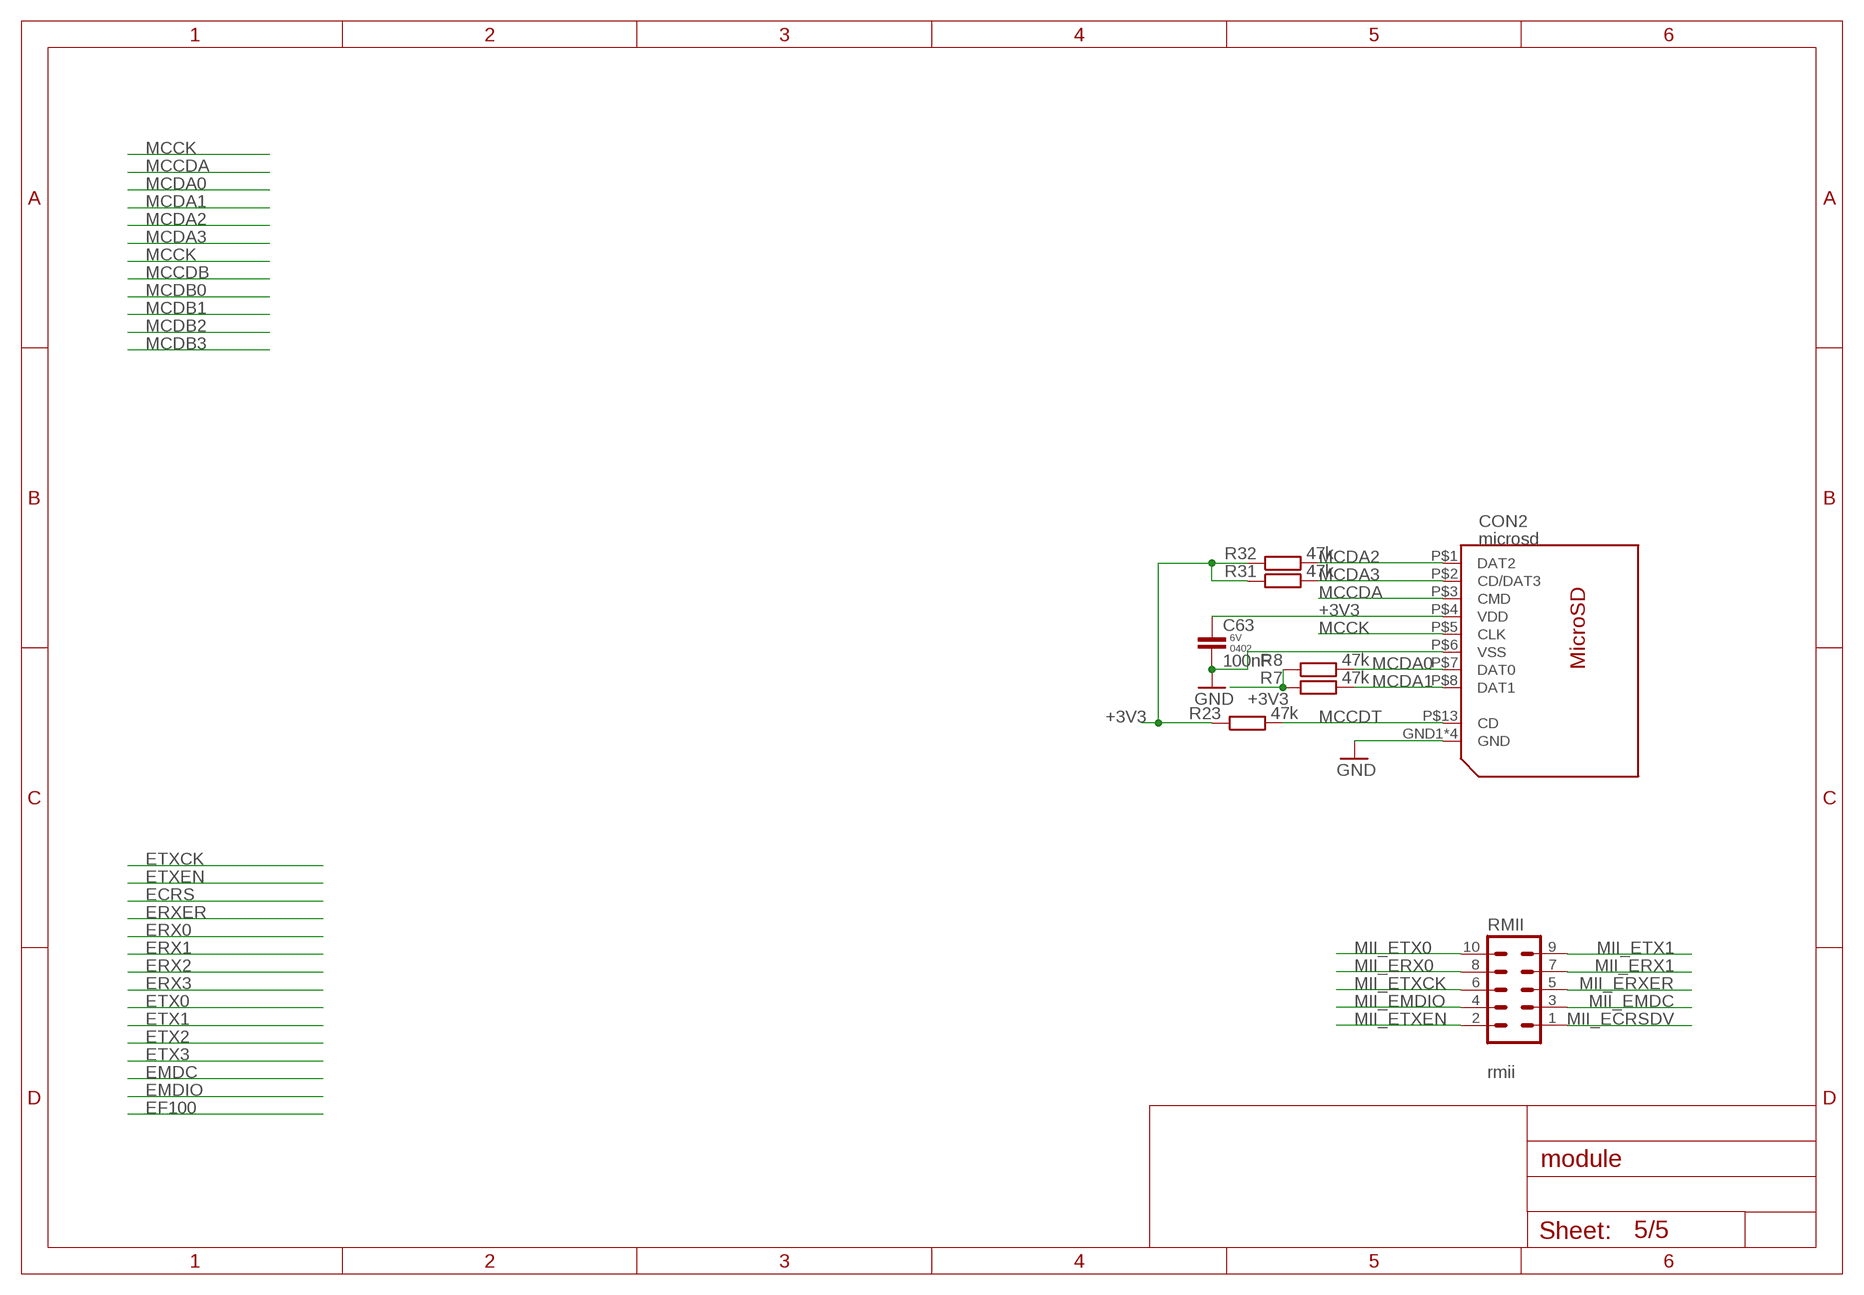
[diagram p4: schematic, sheet 5]

### Parts
C63  100nF  CAP-0402  [C0402K]
CON2  microsd  112J-TXAR  [112J]
R7  47k  R-EU_R0402  [R0402]
R8  47k  R-EU_R0402  [R0402]
R23  47k  R-EU_R0402  [R0402]
R31  47k  R-EU_R0402  [R0402]
R32  47k  R-EU_R0402  [R0402]
RMII  rmii  MA05-2  [MA05-2]

### Nets
+3V3: C63.1 CON2.P$4(VDD) R7.1 R8.1 R23.1 R31.1 R32.1 ; also sheet 1,2,4
GND: C63.2 CON2.GND1(GND) CON2.GND2(GND) CON2.GND3(GND) CON2.GND4(GND) CON2.P$6(VSS) ; also sheet 1,2,3,4
MCCDA: CON2.P$3(CMD) ; also sheet 2
MCCDT: CON2.P$13(CD) R23.2 ; also sheet 2
MCCK: CON2.P$5(CLK) ; also sheet 2
MCDA0: CON2.P$7(DAT0) R8.2 ; also sheet 2
MCDA1: CON2.P$8(DAT1) R7.2 ; also sheet 2
MCDA2: CON2.P$1(DAT2) R32.2 ; also sheet 2
MCDA3: CON2.P$2(CD/DAT3) R31.2 ; also sheet 2
MII_ECRSDV: RMII.1 ; also sheet 2
MII_EMDC: RMII.3 ; also sheet 2
MII_EMDIO: RMII.4 ; also sheet 2
MII_ERX0: RMII.8 ; also sheet 2
MII_ERX1: RMII.7 ; also sheet 2
MII_ERXER: RMII.5 ; also sheet 2
MII_ETX0: RMII.10 ; also sheet 2
MII_ETX1: RMII.9 ; also sheet 2
MII_ETXCK: RMII.6 ; also sheet 2
MII_ETXEN: RMII.2 ; also sheet 2

## Library data of the parts
!RST !WKUP +1V8 +3V3 DRX DTX GND TP3 TP5 = testpad:PTR1: TEST PIN
C1-C11 C13-C18 C20-C22 C25-C42 C48 C49 C51 C52 C63 = parts-passives:CAP-; PACKAGE: 0402; RATING: 6V
C62 = parts-passives:CAP-; PACKAGE: 0603; RATING: 10V
CON1 = parts-amphenol:10118194-00
CON2 = parts-attend:112J-TXAR
F1 = parts-passives:FUSE-PTC-; CURRENT: 0.6A; PACKAGE: 0603
IC1 IC2 = parts-alliance_mem:MT48LC16M16A2: 256Mb: x16 SDRAM MT48LC16M16A2 - 4 Meg x 16 x 4 banks Source: http://download.micron.com/pdf/datasheets/dram/sdram/256MSDRAM.pdf; OC_FARNELL: unknown; OC_NEWARK: unknown
IC3 = parts-microchip:AT91SAM9260-BGA
IC6 = parts-adesto:AT45DB
J1 J2 = parts-helpers:JUMP-
L3 = parts-passives:IND-; CURRENT: 10mA; PACKAGE: 0402
LED1 = parts-optosupply:OSTB1204
Q1 = parts-srpassives:3215: SMD Crystal 3.2x2.5
Q2 = parts-iqd:CFPX–217: 32.768
R1-R16 R20-R35 R37-R39 = rcl:R-EU_: RESISTOR, European symbol; SPICEPREFIX: R
RMII = parts-passives:MA05-2: PIN HEADER; OC_FARNELL: unknown; OC_NEWARK: unknown
RN1-RN8 = parts-royal_ohm:4D02WGJ; CASE: 0402
SV1 = parts-passives:MA18-2: PIN HEADER; OC_FARNELL: unknown; OC_NEWARK: unknown
U$1-U$3 = adafruit:FIDUCIAL: For use by pick and place machines to calibrate the vision/machine, 1mm By microbuilder.eu
USB = parts-passives:MA05-1: PIN HEADER; OC_FARNELL: unknown; OC_NEWARK: unknown

## Net classes
1 sdram: width 0.15 mm, drill 0.3 mm, clearance 0.45 mm

## Board
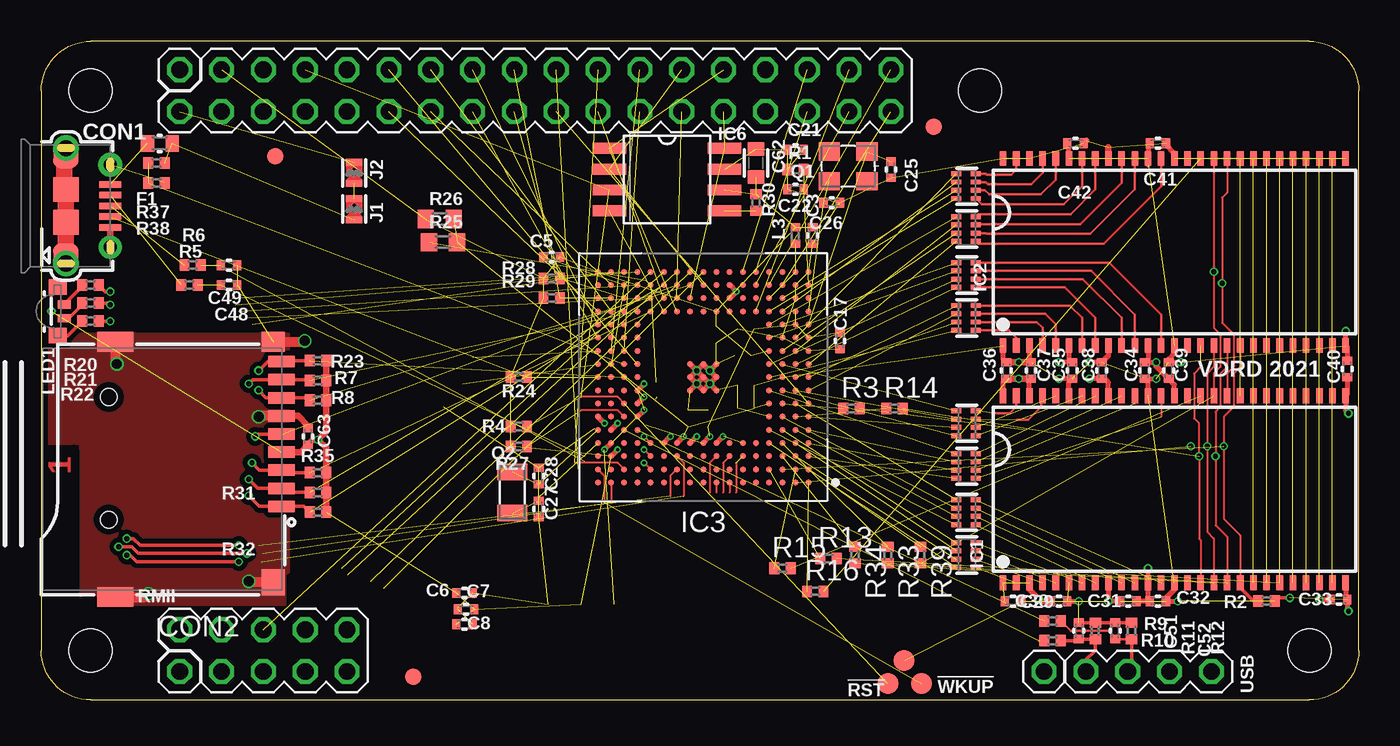
[diagram p5: board, top side]
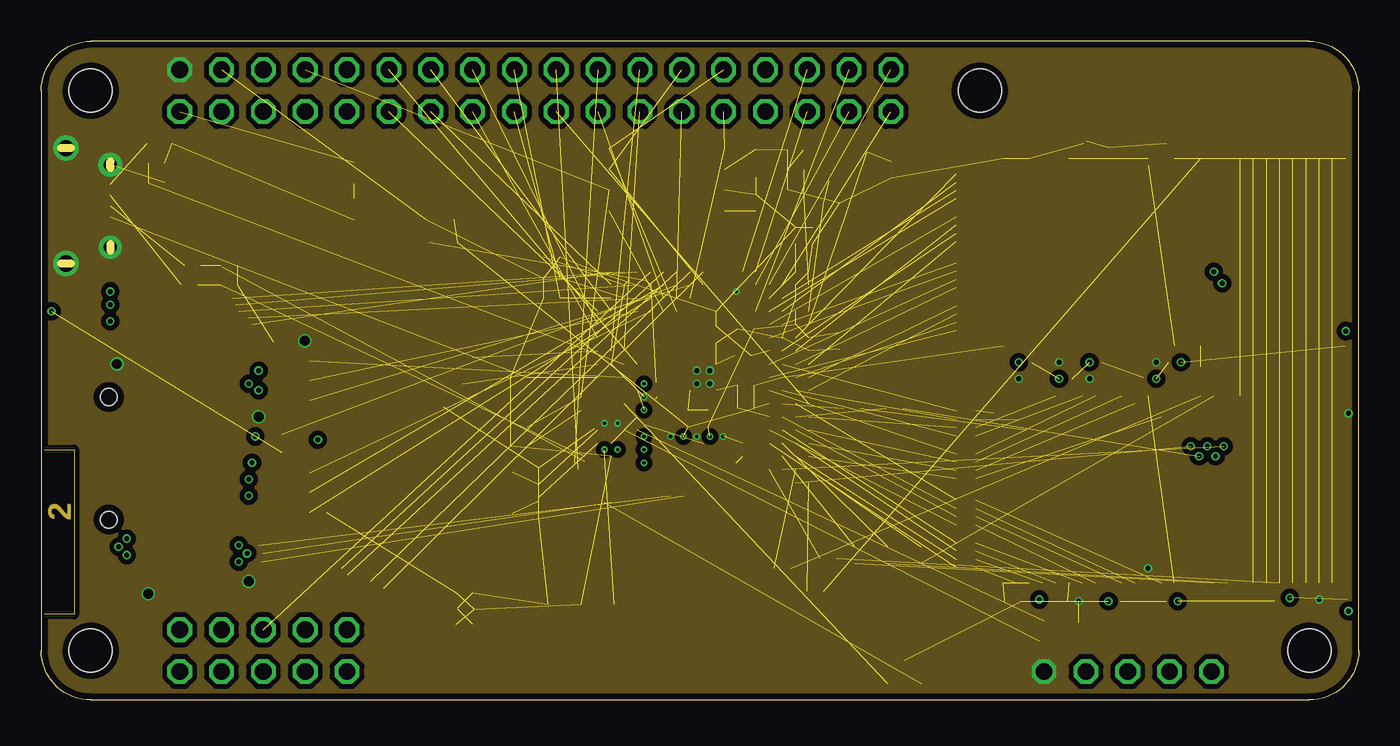
[diagram p6: board, inner layer Route2]
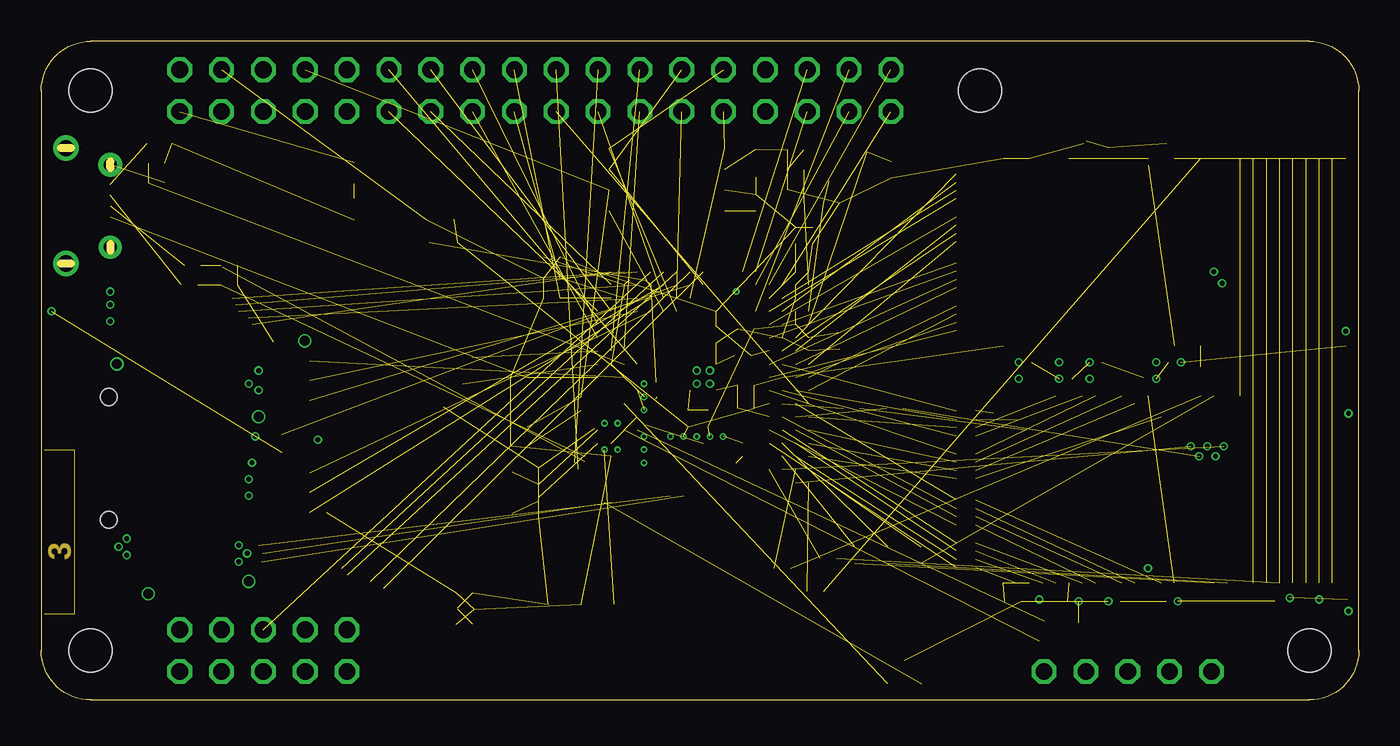
[diagram p7: board, inner layer Route15]
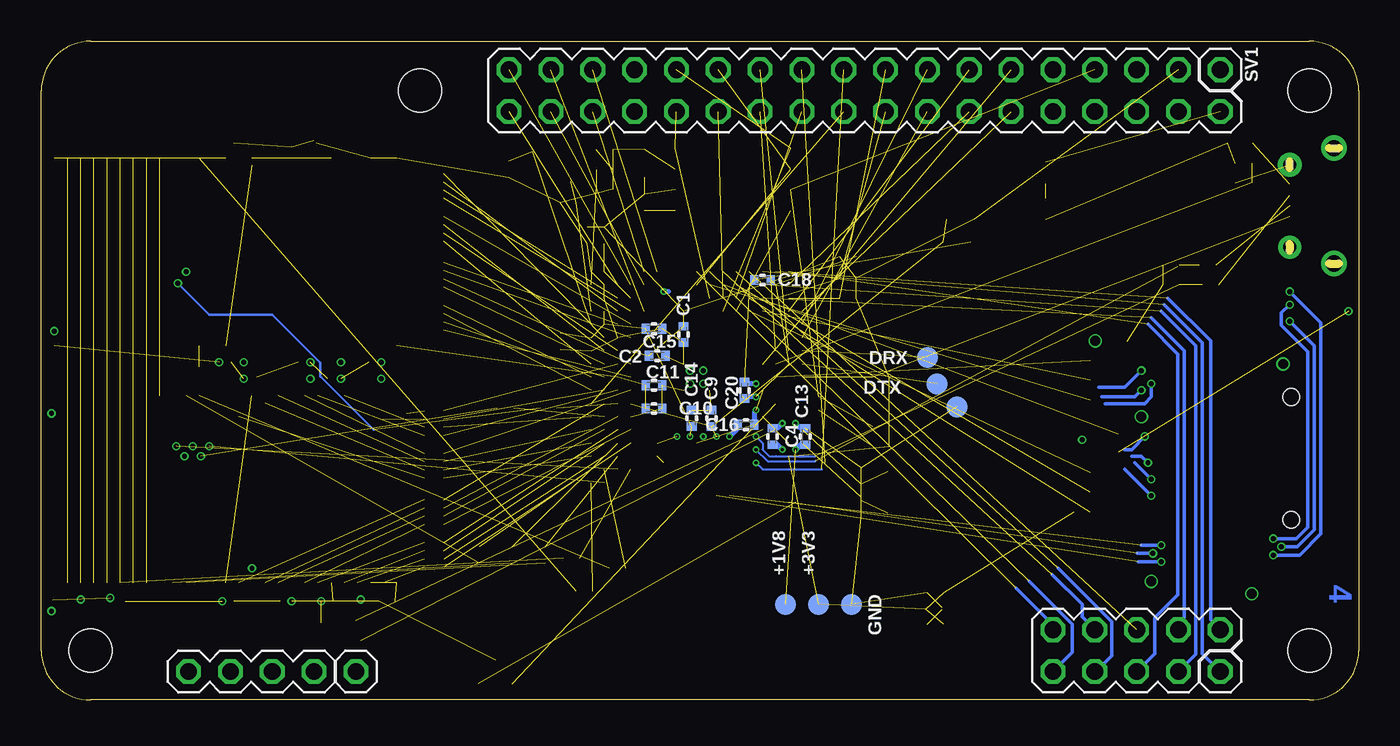
[diagram p8: board, bottom side, seen from below]

Size 80 x 40 mm. Coordinates in mm from the lower left corner, seen from the top.
Outline: 3,0 77,0 arc90 80,3 80,37 arc90 77,40 3,40 arc90 0,37 0,3 arc90 3,0
Copper layers (1+2*15+16): Top 0.035mm / dielectric 0.2mm / Route2 0.0175mm / dielectric 0.465mm / Route15 0.0175mm / dielectric 0.2mm / Bottom 0.035mm
Design rules "default *": minimum track width 4mil, minimum drill 0.2mm, track to track 5mil, track to pad 5mil, pad to pad 5mil, via to via 5mil, smd to smd 5mil, copper to edge 0.4mm, drill to drill 6mil, minimum pad ring 4mil, minimum via ring 4mil, stop-mask expansion 0.1mm, vias tented up to drill 0.3mm, thermal gap 10mil
Holes 2.6 mm at 3,37 3,3 77,3 57,37
tRestrict: area 0,34 to 6,40; area 0,0 to 6,6; area 74,0 to 80,6; area 54,34 to 60,40; area 0,5.2 to 2,15.2
bRestrict: area 0,34 to 6,40; area 0,0 to 6,6; area 74,0 to 80,6; area 54,34 to 60,40; area 0,5.2 to 2,15.2

### Footprints (pad centres in the part's own frame; a part is rotated, then mirrored left to right if it is on the bottom)
B1,27 = smd 1.27 x 1.27: TP 0,0
C0402K = smd 0.5 x 0.6: 1 -0.5,0; 2 0.5,0
C0603 = smd 0.8 x 1: 1 -0.85,0; 2 0.85,0
10118194 = smd 0.4 x 1.35: 1 -1.3,2.7; 2 -0.65,2.7; 3 0,2.7; 4 0.65,2.7; 5 1.3,2.7 | drill 0.8 pad 1.45: SH1 -2.5,2.7 | drill 0.8 pad 1.4: SH2 2.5,2.7 | drill 1 pad 1.55: SH3 -3.5,0; SH8 3.5,0 | smd 1.5 x 1.55: SH4 -3.05,0; SH5 -1,0; SH6 1,0; SH7 3.05,0
112J = smd 1.2 x 1.4: GND1 -7.75,-0.5 | smd 1.2 x 2.2: GND2 -7.75,-10.1; GND3 7.75,-10.1 | smd 1.6 x 1.4: GND4 6.85,-0.5 | smd 0.7 x 1.6: P$1 2.25,0; P$2 1.15,0; P$3 0.05,0; P$4 -1.05,0; P$5 -2.15,0; P$6 -3.25,0; P$7 -4.35,0; P$8 -5.45,0; P$13 -6.55,0 | hole 1: -4.4,-10.5; 3.05,-10.5
F0603 = smd 0.8 x 1: 1 -0.75,0; 2 0.75,0
TSOP54-400 = smd 0.4 x 0.9: 1 -10.4,-5.68; 2 -9.6,-5.68; 3 -8.8,-5.68; 4 -8,-5.68; 5 -7.2,-5.68; 6 -6.4,-5.68; 7 -5.6,-5.68; 8 -4.8,-5.68; 9 -4,-5.68; 10 -3.2,-5.68; 11 -2.4,-5.68; 12 -1.6,-5.68; 13 -0.8,-5.68; 14 0,-5.68; 15 0.8,-5.68; 16 1.6,-5.68; 17 2.4,-5.68; 18 3.2,-5.68; 19 4,-5.68; 20 4.8,-5.68; 21 5.6,-5.68; 22 6.4,-5.68; 23 7.2,-5.68; 24 8,-5.68; 25 8.8,-5.68; 26 9.6,-5.68; 27 10.4,-5.68; 28 10.4,5.68; 29 9.6,5.68; 30 8.8,5.68; 31 8,5.68; 32 7.2,5.68; 33 6.4,5.68; 34 5.6,5.68; 35 4.8,5.68; 36 4,5.68; 37 3.2,5.68; 38 2.4,5.68; 39 1.6,5.68; 40 0.8,5.68; 41 0,5.68; 42 -0.8,5.68; 43 -1.6,5.68; 44 -2.4,5.68; 45 -3.2,5.68; 46 -4,5.68; 47 -4.8,5.68; 48 -5.6,5.68; 49 -6.4,5.68; 50 -7.2,5.68; 51 -8,5.68; 52 -8.8,5.68; 53 -9.6,5.68; 54 -10.4,5.68
BGA217C80P17X17_1500X1500X100 = smd 0.35 x 0.35: A1 -6.4,6.4; A2 -5.6,6.4; A3 -4.8,6.4; A4 -4,6.4; A5 -3.2,6.4; A6 -2.4,6.4; A7 -1.6,6.4; A8 -0.8,6.4; A9 0,6.4; A10 0.8,6.4; A11 1.6,6.4; A12 2.4,6.4; A13 3.2,6.4; A14 4,6.4; A15 4.8,6.4; A16 5.6,6.4; A17 6.4,6.4; B1 -6.4,5.6; B2 -5.6,5.6; B3 -4.8,5.6; B4 -4,5.6; B5 -3.2,5.6; B6 -2.4,5.6; B7 -1.6,5.6; B8 -0.8,5.6; B9 0,5.6; B10 0.8,5.6; B11 1.6,5.6; B12 2.4,5.6; B13 3.2,5.6; B14 4,5.6; B15 4.8,5.6; B16 5.6,5.6; B17 6.4,5.6; C1 -6.4,4.8; C2 -5.6,4.8; C3 -4.8,4.8; C4 -4,4.8; C5 -3.2,4.8; C6 -2.4,4.8; C7 -1.6,4.8; C8 -0.8,4.8; C9 0,4.8; C10 0.8,4.8; C11 1.6,4.8; C12 2.4,4.8; C13 3.2,4.8; C14 4,4.8; C15 4.8,4.8; C16 5.6,4.8; C17 6.4,4.8; D1 -6.4,4; D2 -5.6,4; D3 -4.8,4; D4 -4,4; D5 -3.2,4; D6 -2.4,4; D7 -1.6,4; D8 -0.8,4; D9 0,4; D10 0.8,4; D11 1.6,4; D12 2.4,4; D13 3.2,4; D14 4,4; D15 4.8,4; D16 5.6,4; D17 6.4,4; E1 -6.4,3.2; E2 -5.6,3.2; E3 -4.8,3.2; E4 -4,3.2; E14 4,3.2; E15 4.8,3.2; E16 5.6,3.2; E17 6.4,3.2; F1 -6.4,2.4; F2 -5.6,2.4; F3 -4.8,2.4; F4 -4,2.4; F14 4,2.4; F15 4.8,2.4; F16 5.6,2.4; F17 6.4,2.4; G1 -6.4,1.6; G2 -5.6,1.6; G3 -4.8,1.6; G4 -4,1.6; G14 4,1.6; G15 4.8,1.6; G16 5.6,1.6; G17 6.4,1.6; H1 -6.4,0.8; H2 -5.6,0.8; H3 -4.8,0.8; H4 -4,0.8; H8 -0.8,0.8; H9 0,0.8; H10 0.8,0.8; H14 4,0.8; H15 4.8,0.8; H16 5.6,0.8; H17 6.4,0.8; J1 -6.4,0; J2 -5.6,0; J3 -4.8,0; J4 -4,0; J8 -0.8,0; J9 0,0; J10 0.8,0; J14 4,0; J15 4.8,0; J16 5.6,0; J17 6.4,0; K1 -6.4,-0.8; K2 -5.6,-0.8; K3 -4.8,-0.8; K4 -4,-0.8; K8 -0.8,-0.8; K9 0,-0.8; K10 0.8,-0.8; K14 4,-0.8; K15 4.8,-0.8; K16 5.6,-0.8; K17 6.4,-0.8; L1 -6.4,-1.6; L2 -5.6,-1.6; L3 -4.8,-1.6; L4 -4,-1.6; L14 4,-1.6; L15 4.8,-1.6; L16 5.6,-1.6; L17 6.4,-1.6; M1 -6.4,-2.4; M2 -5.6,-2.4; M3 -4.8,-2.4; M4 -4,-2.4; M14 4,-2.4; M15 4.8,-2.4; M16 5.6,-2.4; M17 6.4,-2.4; N1 -6.4,-3.2; N2 -5.6,-3.2; N3 -4.8,-3.2; N4 -4,-3.2; N14 4,-3.2; N15 4.8,-3.2; N16 5.6,-3.2; N17 6.4,-3.2; P1 -6.4,-4; P2 -5.6,-4; P3 -4.8,-4; P4 -4,-4; P5 -3.2,-4; P6 -2.4,-4; P7 -1.6,-4; P8 -0.8,-4; P9 0,-4; P10 0.8,-4; P11 1.6,-4; P12 2.4,-4; P13 3.2,-4; P14 4,-4; P15 4.8,-4; P16 5.6,-4; P17 6.4,-4; R1 -6.4,-4.8; R2 -5.6,-4.8; R3 -4.8,-4.8; R4 -4,-4.8; R5 -3.2,-4.8; R6 -2.4,-4.8; R7 -1.6,-4.8; R8 -0.8,-4.8; R9 0,-4.8; R10 0.8,-4.8; R11 1.6,-4.8; R12 2.4,-4.8; R13 3.2,-4.8; R14 4,-4.8; R15 4.8,-4.8; R16 5.6,-4.8; R17 6.4,-4.8; T1 -6.4,-5.6; T2 -5.6,-5.6; T3 -4.8,-5.6; T4 -4,-5.6; T5 -3.2,-5.6; T6 -2.4,-5.6; T7 -1.6,-5.6; T8 -0.8,-5.6; T9 0,-5.6; T10 0.8,-5.6; T11 1.6,-5.6; T12 2.4,-5.6; T13 3.2,-5.6; T14 4,-5.6; T15 4.8,-5.6; T16 5.6,-5.6; T17 6.4,-5.6; U1 -6.4,-6.4; U2 -5.6,-6.4; U3 -4.8,-6.4; U4 -4,-6.4; U5 -3.2,-6.4; U6 -2.4,-6.4; U7 -1.6,-6.4; U8 -0.8,-6.4; U9 0,-6.4; U10 0.8,-6.4; U11 1.6,-6.4; U12 2.4,-6.4; U13 3.2,-6.4; U14 4,-6.4; U15 4.8,-6.4; U16 5.6,-6.4; U17 6.4,-6.4
SO08-208 = smd 0.66 x 2.032: 1 -1.905,-3.498; 2 -0.635,-3.498; 3 0.635,-3.498; 4 1.905,-3.498; 5 1.905,3.498; 6 0.635,3.498; 7 -0.635,3.498; 8 -1.905,3.498
C0603' = smd 0.4 x 1: 1 -0.65,0; 2 0.65,0
L0402 = smd 0.5 x 0.6: 1 -0.5,0; 2 0.5,0
321015RGB = smd 0.5 x 0.8: 1 -0.415,0.4; 4 0.415,0.4 | smd 0.95 x 1.1: 2 -1.475,0; 3 1.475,0
3215 = smd 1.3 x 1.1: 1 -1.15,-0.9; 2 1.15,-0.9; 3 1.15,0.9; 4 -1.15,0.9
3215' = smd 1 x 1.8: 1 -1.25,0; 2 1.25,0
R0402 = smd 0.6 x 0.7: 1 -0.5,0; 2 0.5,0
R0603 = smd 1 x 1.1: 1 -0.85,0; 2 0.85,0
MA05-2 = drill 1.016 pad 1.5 octagon: 1 -5.08,-1.27; 2 -5.08,1.27; 3 -2.54,-1.27; 4 -2.54,1.27; 5 0,-1.27; 6 0,1.27; 7 2.54,-1.27; 8 2.54,1.27; 9 5.08,-1.27; 10 5.08,1.27
4D02 = smd 0.3 x 0.6: 1 -0.75,-0.65; 2 -0.25,-0.65; 3 0.25,-0.65; 4 0.75,-0.65; 5 0.75,0.55; 6 0.25,0.55; 7 -0.25,0.55; 8 -0.75,0.55
MA18-2 = drill 1.016 pad 1.5 octagon: 1 -21.59,-1.27; 2 -21.59,1.27; 3 -19.05,-1.27; 4 -19.05,1.27; 5 -16.51,-1.27; 6 -16.51,1.27; 7 -13.97,-1.27; 8 -13.97,1.27; 9 -11.43,-1.27; 10 -11.43,1.27; 11 -8.89,-1.27; 12 -8.89,1.27; 13 -6.35,-1.27; 14 -6.35,1.27; 15 -3.81,-1.27; 16 -3.81,1.27; 17 -1.27,-1.27; 18 -1.27,1.27; 19 1.27,-1.27; 20 1.27,1.27; 21 3.81,-1.27; 22 3.81,1.27; 23 6.35,-1.27; 24 6.35,1.27; 25 8.89,-1.27; 26 8.89,1.27; 27 11.43,-1.27; 28 11.43,1.27; 29 13.97,-1.27; 30 13.97,1.27; 31 16.51,-1.27; 32 16.51,1.27; 33 19.05,-1.27; 34 19.05,1.27; 35 21.59,-1.27; 36 21.59,1.27
FIDUCIAL_1MM = smd 1 x 1: 1 0,0
MA05-1 = drill 1.016 pad 1.5 octagon: 1 -5.08,0; 2 -2.54,0; 3 0,0; 4 2.54,0; 5 5.08,0

### Placement (x,y rotation side)
!RST  51.4,1 0 top
!WKUP  53.45,1 0 top
+1V8  34.8,5.8 270 bottom
+3V3  32.8,5.8 270 bottom
C1  41,22.2 270 bottom
C2  42.6,20.9 0 bottom
C3  46.85,28.2 270 top
C4  35.6,16 90 bottom
C5  31,26.9 180 top
C6  25.7,6.5 0 top
C7  25.7,4.6 0 top
C8  25.8,5.5 180 top
C9  39.3,17.1 90 bottom
C10  42.8,17.7 0 bottom
C11  42.8,19.1 0 bottom
C13  33.6,16 90 bottom
C14  40.5,17.1 90 bottom
C15  42.8,22.55 0 bottom
C16  37.2,16.7 180 bottom
C17  48.5,21.8 270 top
C18  36.2,25.5 0 bottom
C20  37.3,18.8 270 bottom
C21  45.8,33.4 180 top
C22  45.8,31 180 top
C25  51.6,32.2 270 top
C26  48,30.2 0 top
C27  30.2,11.6 270 top
C28  30.2,13.6 90 top
C29  59,6 0 top
C30  61.8,6 0 top
C31  66,6 0 top
C32  67.8,6 180 top
C33  78.8,6.1 180 top
C34  67,20 90 top
C35  62.6,20 90 top
C36  58.6,20 270 top
C37  60.1,20 270 top
C38  64.4,20 270 top
C39  68.45,20 270 top
C40  79.3,20.1 270 top
C41  67.8,33.8 0 top
C42  62.8,33.8 0 top
C48  11.4,25.2 0 top
C49  11.4,26.4 0 top
C51  63,4.2 90 top
C52  65.2,4.2 90 top
C62  43.4,32.6 90 top
C63  16.2,16 90 top
CON1  1.5,30 270 top
CON2  14.6,14 270 top
DRX  26.2,20.8 270 bottom
DTX  25.6,19.2 90 bottom
F1  7.2,33.8 0 top
GND  30.8,5.8 270 bottom
IC1  68.8,12.8 0 top
IC2  68.8,27.2 0 top
IC3  40.2,19.6 180 top
IC6  38,31.6 270 top
J1  JUMP-0603  [C0603']  19,29.8 90 top
J2  JUMP-0603  [C0603']  19,32 90 top
L3  45.8,28.2 270 top
LED1  1,23.6 270 top
Q1  49,32.4 180 top
Q2  32.768kHz  [3215']  28.6,12.6 90 top
R1  45.8,32.2 0 top
R2  74.4,6 0 top
R3  49.2,17.7 0 top
R4  29,16.6 0 top
R5  9,25.2 0 top
R6  9.2,26.4 0 top
R7  16.8,19.4 180 top
R8  16.8,18.2 180 top
R9  61.4,4.8 0 top
R10  61.4,3.6 0 top
R11  64,4.2 270 top
R12  66.2,4.2 270 top
R13  47.8,8.6 0 top
R14  51.8,17.7 0 top
R15  45,8 0 top
R16  47,6.6 0 top
R20  3,25.2 180 top
R21  3,24.1 180 top
R22  3,23 180 top
R23  16.8,20.6 180 top
R24  29,19.6 180 top
R25  24.4,27.8 0 top
R26  24.2,29.2 180 top
R27  29,15.4 180 top
R28  31,25.6 180 top
R29  31,24.4 180 top
R30  43.4,30.2 90 top
R31  16.8,12.6 180 top
R32  16.8,11.4 180 top
R33  51.4,8.8 270 top
R34  49.4,8.8 270 top
R35  16.8,13.8 0 top
R37  7,32.6 0 top
R38  7,31.4 180 top
R39  53.4,8.8 270 top
RMII  13.49,3 0 top
RN1  56.2,8.8 270 top
RN2  56.2,11.4 270 top
RN3  56.2,16.8 270 top
RN4  56.2,14.2 270 top
RN5  56.2,31.2 270 top
RN6  56.2,28.6 270 top
RN7  56.2,25.8 270 top
RN8  56.2,23.2 270 top
SV1  30,37 180 bottom
TP3  52.4,2.4 0 top
TP5  24.4,17.8 180 bottom
U$1  22.6,1.4 0 top
U$2  14.2,33 0 top
U$3  54.2,34.8 0 top
USB  65.97,1.73 0 top

### Tracks (layer width: path | path; a pad name or v marks a point on that pad's centre or on a via)
!RST  (4 unrouted)
  Top 0.13: IC3.G15 35,18.4 32.8,18.4
!WKUP  (1 unrouted)
  Top 0.13: IC3.B17 34.2,13.6 34.2,12
+1V8  (via drill 0.2)  (13 unrouted)
  Top 0.3: IC3.D9 v40.6,16 | IC3.D16 v34.2,15.2 | IC3.F14 v36.6,17.6 | IC3.H14 v36.6,19.2
  Bottom 0.3: v36.6,17.6 36.7,17.5 C16.1 | v36.6,19.2 37.2,19.2 C20.1 | C13.1 33.9,15.5 v34.2,15.2
+3V3  (via drill 0.2, 0.3, 0.3 pad 0.3)  (24 unrouted)
  Top 0.2: LED1.2 0.63,24.7 v0.63,23.6
  Top 0.3: C7.1 25.1,4.5 | IC3.C16 v35,15.2
  Top 0.4: R32.1 R31.1 R35.2 17.3,15.3 v16.8,15.8 | v16.8,15.8 17.3,16.3 R8.1 R7.1 R23.1 | CON2.P$4 15.75,15.05 C63.1 16.5,15.8 v16.8,15.8
  Bottom 0.3: C4.1 35.3,15.5 v35,15.2
+5V  (1 unrouted)
A2  (1 unrouted)
A3  (1 unrouted)
A4  (1 unrouted)
A5  (1 unrouted)
A6  (1 unrouted)
A7  (1 unrouted)
A8  (1 unrouted)
A9  (1 unrouted)
A10  (1 unrouted)
A11  (1 unrouted)
A13  (1 unrouted)
A14  (1 unrouted)
A16  (1 unrouted)
A17  (1 unrouted)
ADDR0  (via drill 0.3)  (1 unrouted)
  other vias: 69.8,15.4
ADDR9  (1 unrouted)
  Top 0.13: 42.2,14.4 42.2,12.6
ADDR13
  Top 0.13: IC3.A7 41.8,12.6
ADDR14
  Top 0.13: IC3.C7 41.4,14.4 41.4,12.6
ADDR16
  Top 0.13: IC3.A8 41,12.6
ADDR17
  Top 0.13: IC3.C8 40.6,14.4 40.6,12.6
BMS  (1 unrouted)
  Top 0.13: IC3.F15 35,17.6 32.8,17.6
CAPE_EN1  (1 unrouted)
CAPE_EN2  (1 unrouted)
CAS  (1 unrouted)
CFIOR_NBS1_NWR1  (1 unrouted)
CFIOW_NBS3_NWR3  (1 unrouted)
D3  (1 unrouted)
D4  (1 unrouted)
D5  (1 unrouted)
D6  (1 unrouted)
D7  (1 unrouted)
D8  (1 unrouted)
D9  (1 unrouted)
D10  (1 unrouted)
D11  (1 unrouted)
D12  (1 unrouted)
D13  (1 unrouted)
D14  (1 unrouted)
D15  (1 unrouted)
DATA0  (1 unrouted)
DATA1  (1 unrouted)
DATA2  (1 unrouted)
DATA3  (1 unrouted)
DATA4  (1 unrouted)
DATA5  (1 unrouted)
DATA6  (1 unrouted)
DATA7  (1 unrouted)
DATA8  (1 unrouted)
  Top 0.127: IC1.42 68,17.2
DATA9  (1 unrouted)
  Top 0.154: IC1.44 66.4,18.03
DATA10  (1 unrouted)
DATA11  (1 unrouted)
  Top 0.154: IC1.47 64.1,18.38
DATA12  (1 unrouted)
DATA13  (1 unrouted)
DATA14  (1 unrouted)
  Top 0.16: IC1.51 60.73,18.41 60.73,17.81 59.92,17 59.26,17
DATA15  (1 unrouted)
  Top 0.16: IC1.53 59.2,17.8 58.8,17.4 57.8,17.4
DATA16
  Top 0.16: RN8.5 58.75,22.45 59.2,22 IC2.2
DATA17
  Top 0.154: 60.8,21.6 IC2.4
  Top 0.16: RN8.6 60.45,22.95 60.8,22.6 IC2.4
DATA18
  Top 0.16: RN8.7 60.95,23.45 61.6,22.8 IC2.5
DATA19
  Top 0.16: RN8.8 62.45,23.95 63.2,23.2 IC2.7
DATA20
  Top 0.16: RN7.5 62.15,25.05 64,23.2 IC2.8
DATA21
  Top 0.154: IC2.10 65.6,21.8
  Top 0.16: RN7.6 63.25,25.55 65.6,23.2 IC2.10
DATA22
  Top 0.154: IC2.11 66.4,21.8
  Top 0.16: RN7.7 63.75,26.05 66.4,23.4 IC2.11
DATA23
  Top 0.154: IC2.13 68,21.8
  Top 0.16: RN7.8 64.85,26.55 68,23.4 IC2.13
DATA24
  Top 0.154: 68,32.4 IC2.42
  Top 0.16: RN6.5 56.9,27.7 64.5,27.7 68,31.2 68,32.4
DATA25
  Top 0.16: IC2.44 66.4,31 63.7,28.3 57.4,28.3 57.35,28.35 RN6.6
DATA26
  Top 0.16: RN6.7 56.8,28.9 63.1,28.9 65.6,31.4 IC2.45
DATA27
  Top 0.16: RN6.8 56.9,29.5 62.5,29.5 64,31 IC2.47
DATA28
  Top 0.154: 63.2,32.68 63.2,32.8 IC2.48
  Top 0.16: RN5.5 57.1,30.1 62.1,30.1 63.2,31.2 63.2,32.8
DATA29
  Top 0.16: RN5.6 57.3,30.95 57.55,30.7 60.7,30.7 61.6,31.6 IC2.50
DATA30
  Top 0.154: 60.8,32.6 IC2.51
  Top 0.16: RN5.7 57.35,31.45 57.5,31.3 60.1,31.3 60.8,32 IC2.51
DATA31
  Top 0.16: RN5.8 57.35,31.95 57.4,31.9 58.9,31.9 59.2,32.2 IC2.53
DQ0  (1 unrouted)
DQ1  (1 unrouted)
DQ2  (1 unrouted)
DQ16  (1 unrouted)
DQ17  (1 unrouted)
DQ18  (1 unrouted)
DQ19  (1 unrouted)
DQ20  (1 unrouted)
DQ21  (1 unrouted)
DQ22  (1 unrouted)
DQ23  (1 unrouted)
DQ24  (1 unrouted)
DQ25  (1 unrouted)
DQ26  (1 unrouted)
DQ27  (1 unrouted)
DQ28  (1 unrouted)
DQ29  (1 unrouted)
DQ30  (1 unrouted)
DQ31  (1 unrouted)
DRX  (1 unrouted)
DTX  (1 unrouted)
FIQ  (via drill 0.2)  (1 unrouted)
  Top 0.13: IC3.B13 v36.6,14.4
  Bottom 0.13: v36.6,14.4 36.2,14 32.6,14
GND  (via drill 0.2, 0.3, 0.6)  (47 unrouted)
  Top 0.154: C8.2 25.3,5.6
  Top 0.2: C51.2 R11.1 C52.2 R12.1
  Top 0.3: IC1.41 68.8,19.15 C39.2 67.7,20.25 v67.7,20.5 C34.2 67.2,20.7 IC2.12 | C40.2 79.3,18.58 IC1.28 79.2,17.57 v79.37,17.4 | IC1.52 60,19.4 C37.2 | IC2.6 62.4,20.7 C35.2 v61.8,20.5 | IC1.46 64.8,19.28 64.58,19.5 C38.2 v63.65,19.5 | C33.2 v77.6,6.1 | IC2.41 68.8,33.2 68.3,33.7 C41.2 | C30.2 v63,6 | C32.2 C31.2 | 67.2,6.2 IC1.12 v67.2,8 | IC1.54 58.4,19.3 C36.2 | IC3.T7 v42.2,24.8 IC3.R7 | IC3.D8 v41.4,16 | IC3.D10 v39.8,16 | IC3.D12 v38.2,16 | IC3.G14 v36.6,18.4 | IC3.H10 v39.8,19.2 | IC3.H8 v40.6,19.2 | IC3.K8 v40.6,20 | IC3.K10 v39.8,20 | IC3.J9 v39.8,20 | v39.8,20 IC3.K9 v40.6,20 | v40.6,19.2 IC3.J8 v40.6,20 | IC3.J9 v40.6,19.2 | IC3.J9 v39.8,19.2 | v40.6,19.2 IC3.H9 v39.8,19.2 | v39.8,19.2 IC3.J10 v39.8,20 | IC3.F17 v34.2,16.8 | IC3.E16 v35,16.8
  Top 0.4: IC2.46 64.8,33.55 | 63.45,33.95 C42.2 | 4.4,21.8 4.45,21.8 CON2.GND2 | CON2.P$6 15.6,17.25 16.2,16.65 C63.2 | C32.2 67.2,6.1 67.2,6.2 | CON1.5 CON1.SH2 | C37.2 v59.35,19.5 C36.2
  Top 0.6: v4.6,20.4 4.5,20.5 CON2.GND2 | CON2.GND3 6.3,6.25 v6.5,6.45 | CON2.GND4 12.65,7.15 v12.6,7.2 | v16,21.8 15.95,21.75 CON2.GND1 | CON2.P$6 13.25,17.25 v13.2,17.2
  Top 1: CON1.SH4 1.5,32.6 1.4,32.6 1.4,31.1 CON1.SH5 CON1.SH6 CON1.SH7 CON1.SH8
  Bottom 0.3: 41.9,24.8 v42.2,24.8 | v38.2,16 37.7,16.5 C16.2 | v36.6,18.4 37.4,18.4 | C13.2 33.9,16.5 v34.2,16.8 | C4.2 35.3,16.5 v35,16.8
  pour Route2 (isolate 0.3, no thermals): -1,-1 -1,41 81,41 81,-1
  pour Top (isolate 0.3, no thermals): 0.4,22.2 15,22.2 15,7.8 14.8,7.6 14.8,5.8 2.4,5.8 2.4,15.6 0.4,15.6
GPIO3  (1 unrouted)
GPIO31  (1 unrouted)
GPIO32  (1 unrouted)
GPIO33  (1 unrouted)
GPIO34  (1 unrouted)
GPIO35  (1 unrouted)
GPIO36  (1 unrouted)
HDMA  (1 unrouted)
  Top 0.154: R10.1 60.6,3.6
HDPA  (1 unrouted)
HSE_IN  (2 unrouted)
HSE_OUT  (2 unrouted)
I2C_SCL  (2 unrouted)
I2C_SDA  (2 unrouted)
IRQ1  (1 unrouted)
IRQ2  (1 unrouted)
  Top 0.13: IC3.B15 35,14.4 32.4,14.4
LED_BLUE  (via drill 0.3)  (1 unrouted)
  Top 0.13: IC3.C11 39,14.4 39,12.4
  Top 0.2: v12,8.4 5.8,8.4 5.4,8.8 v5.2,8.8 | v4.2,24.8 3.9,24.8 R20.1
  Bottom 0.2: 13.4,8.4 v12,8.4 | v4.2,24.8 2.3,22.9 2.3,10.1 3.6,8.8 v5.2,8.8
LED_GREEN  (via drill 0.3)  (1 unrouted)
  Top 0.13: IC3.B11 38.2,13.6 38.2,12.4
  Top 0.2: v12,9.4 6,9.4 5.6,9.8 v5.2,9.8 | v4.2,24 4.1,24.1 R21.1
  Bottom 0.2: 13.2,9.4 v12,9.4 | v4.2,24 4.7,23.5 4.7,22.75 3.1,21.15 3.1,10.5 3.8,9.8 v5.2,9.8
LED_RED  (via drill 0.3)  (1 unrouted)
  Top 0.13: IC3.A16 34.6,12
  Top 0.2: v12.5,8.9 5.9,8.9 5.5,9.3 v4.7,9.3 | v4.2,23 R22.1
  Bottom 0.2: 13.45,8.9 v12.5,8.9 | v4.2,23 2.7,21.5 2.7,10.35 3.75,9.3 v4.7,9.3
LSE_IN  (2 unrouted)
  Top 0.2: C27.1 30.2,12.3
LSE_OUT  (2 unrouted)
MCCDA  (via drill 0.3 pad 0.3)  (1 unrouted)
  Top 0.2: R35.1 14.75,13.8 CON2.P$3 13.25,13.95 v12.8,14.4
  Bottom 0.2: v12.8,14.4 13.2,14.8 13.8,14.8
MCCDT  (via drill 0.3 pad 0.3)  (1 unrouted)
  Top 0.2: R23.2 14.65,20.6 CON2.P$13 13.75,20.55 v13.2,20
  Bottom 0.2: 15.8,19 14.2,19 v13.2,20
MCCK  (via drill 0.3 pad 0.3)  (1 unrouted)
  Top 0.2: CON2.P$5 13.15,16.15 v13,16
  Bottom 0.2: v13,16 13.8,15.2 14.2,15.2
MCDA0  (via drill 0.3 pad 0.3)  (1 unrouted)
  Top 0.2: R8.2 16.15,18.35 CON2.P$7 13.65,18.35 v13.2,18.8
  Bottom 0.2: 15.6,18.4 14,18.4 13.6,18.4 v13.2,18.8
MCDA1  (via drill 0.3 pad 0.3)  (1 unrouted)
  Top 0.2: R7.2 16.25,19.45 CON2.P$8 12.85,19.45 v12.6,19.2
  Bottom 0.2: 15.4,18 13,18 12.6,18.4 v12.6,19.2
MCDA2  (via drill 0.3)  (1 unrouted)
  Top 0.2: v12.6,12.4 13.25,11.75 CON2.P$1 15.95,11.75 R32.2
  Bottom 0.2: 14.2,14 v12.6,12.4
MCDA3  (via drill 0.3 pad 0.3)  (1 unrouted)
  Top 0.2: R31.2 14.85,12.6 CON2.P$2 13.15,12.85 v12.6,13.4
  Bottom 0.2: v12.6,13.4 13.6,14.4
MII_ECRSDV  (1 unrouted)
  Bottom 0.2: RMII.1 9.5,2.82 9.5,21.7 11.8,24
MII_EMDC  (1 unrouted)
  Bottom 0.2: RMII.3 9.9,2.78 9.9,15.6 9.9,21.5 12,23.6
MII_EMDIO  (1 unrouted)
  Bottom 0.2: RMII.4 10.95,4.67 10.6,5.02 10.6,21.2 12.6,23.2
MII_ERX0  (1 unrouted)
  Bottom 0.2: RMII.8 16.8,5.04 16.8,5.8 18.6,7.6
MII_ERX1  (1 unrouted)
  Bottom 0.2: RMII.7 15.97,1.73 15,2.7 15,4.75 18.25,8
MII_ERXER  (1 unrouted)
  Bottom 0.2: RMII.5 12.4,2.82 12.4,5 11,6.4 11,21 12.8,22.8
MII_ETX0  (1 unrouted)
  Bottom 0.2: RMII.10 18.6,4.3 18.6,4.6 20.8,6.8
MII_ETX1  (1 unrouted)
  Bottom 0.2: RMII.9 17.4,2.9 17.4,4.6 20,7.2
MII_ETXCK  (1 unrouted)
MII_ETXEN  (1 unrouted)
  Bottom 0.2: RMII.2 9,4.86 9,21.8 11.6,24.4
N$1  (1 unrouted)
N$2  (1 unrouted)
N$4  (1 unrouted)
N$5
  Route2 0: 0.2,15.2 2,15.2 2,5.2 0.2,5.2
N$7
  Route15 0: 0.2,15.2 2,15.2 2,5.2 0.2,5.2
N$9
  Top 0.2: LED1.1 2.5,25.11 R20.2
N$14
  Top 0.2: LED1.4 1.69,23.18 2.5,24 R21.2
N$23
  Top 0.2: LED1.3 1.62,22.12 R22.2
N$28  (2 unrouted)
PLLRCA  (2 unrouted)
R_CAS  (via drill 0.3)  (1 unrouted)
  Top 0.127: IC2.17 71.2,20.22 70.8,19.82 v70.8,15.4 70.8,10.2 71.2,9.8 IC1.17
R_CFIOR_NBS1_NWR1  (1 unrouted)
R_CFIOW_NBS3_NWR3  (1 unrouted)
R_RAS  (via drill 0.3)  (1 unrouted)
  Top 0.127: IC1.18 72,9.9 71.3,10.6 v71.3,14.8 71.3,17.5 71.6,17.8 71.6,19.82 72,20.22 IC2.18
R_SDA10  (2 unrouted)
R_SDCK  (via drill 0.3)  (1 unrouted)
  Top 0.127: IC2.38 v71.2,26 71.2,22.6 71.6,22.2 71.6,20.23 71.2,19.83 IC1.38
R_SDCKE  (via drill 0.3)  (1 unrouted)
  Top 0.127: IC2.37 72,30.8 71.7,30.5 v71.7,25.3 71.7,22.9 72.4,22.2 72.4,20.23 72,19.83 IC1.37
  Bottom 0.154: v71.7,25.3 69.8,23.4 65.96,23.4 63.04,20.49 63.04,19.64 59.8,16.4
R_SDWE  (via drill 0.3)  (2 unrouted)
  Top 0.127: 70.4,20.22 70,19.82 70,17.1 70.3,16.8 v70.3,14.8 70.3,9.8 70.4,9.7 IC1.16
RAS  (1 unrouted)
SDA10  (1 unrouted)
SDCK  (1 unrouted)
SDCKE  (1 unrouted)
SDCS  (via drill 0.3)  (1 unrouted)
  Top 0.127: IC2.19 72.8,20.22 72.4,19.82 72.4,17.8 71.8,17.2 v71.8,15.4 71.8,11 72.8,10 72.8,7.2 IC1.19
  Top 0.2: IC1.19 72.8,6.92 72.8,6.83 73.63,6 R2.1
SDWE  (1 unrouted)
SPI_CLK  (2 unrouted)
SPI_CSB  (1 unrouted)
SPI_MISO  (2 unrouted)
SPI_MOSI  (2 unrouted)
SPI_NSS  (1 unrouted)
UART_RXD0  (1 unrouted)
UART_RXD1  (1 unrouted)
UART_RXD2  (1 unrouted)
UART_TXD0  (1 unrouted)
UART_TXD1  (1 unrouted)
UART_TXD2  (1 unrouted)
USB_C_DM  (via drill 0.2)  (2 unrouted)
  Top 0.13: IC3.D13 v36.6,16
  Bottom 0.13: 33,14.8 35.4,14.8 35.8,14.8 36.2,15.2 36.2,15.6 v36.6,16
USB_C_DP  (via drill 0.2)  (2 unrouted)
  Top 0.13: IC3.C13 v36.6,15.2
  Top 0.2: 11,26.3 C49.1 10.9,26.5
  Bottom 0.13: 33,14.5 35.9,14.5 v36.6,15.2
USB_H1_DM
  Top 0.2: R10.2 62.9,3.6 C51.1 R11.2 64,3 63.4,2.4 63.4,1.76 USB.2
USB_H1_DP
  Top 0.154: R9.2 62.5,4.2 64.8,4.2 65.2,3.8 C52.1 R12.2
  Top 0.2: R12.2 66.2,1.96 USB.3
USB_VCC  (2 unrouted)
USBC_DM  (1 unrouted)
USBC_DP  (1 unrouted)
USBC_ID  (2 unrouted)
USBC_VDET  (2 unrouted)
VDDRAM  (via drill 0.2, 0.3)  (22 unrouted)
  Top 0.2: R2.2 75.1,6.2 v75.8,6.2
  Top 0.3: IC1.14 68.8,6.7 68.3,6.2 C32.1 v69,6 | IC2.14 68.8,21.05 68.45,20.7 C39.1 v69.2,20.5 | C40.1 79.3,21.42 IC2.27 v79.2,22.4 | IC2.3 60,20.6 C37.1 | IC1.49 62.4,19.3 C35.1 v61.8,19.5 | IC2.9 64.8,20.9 C38.1 v63.65,20.5 | IC1.43 67.2,19.3 C34.1 | C34.1 66.9,19.6 | IC1.27 79.2,6.2 C33.1 79.3,5.47 v79.37,5.4 | 67.2,32.48 IC2.43 67.2,33.7 C41.1 | IC2.49 62.4,33.7 C42.1 62.25,33.75 | IC1.3 60,6.72 60.6,6.12 v60.6,6.1 | IC1.9 v64.8,6 C31.1 | C34.1 v67.7,19.5 | C36.1 58.4,20.7 IC2.1 | IC3.D11 v39,16
  Top 0.4: C30.1 60.7,6 v60.6,6.1 | C37.1 v59.35,20.5 C36.1
VEXT  (1 unrouted)

### Text on the board
Top: 1
Route2: 2
Route15: 3
Bottom: 4
tPlace: VDRD 2021